# EAGLE design arm_board (EAGLE 7.4.0)

## Sheet 1 of 4: I/O
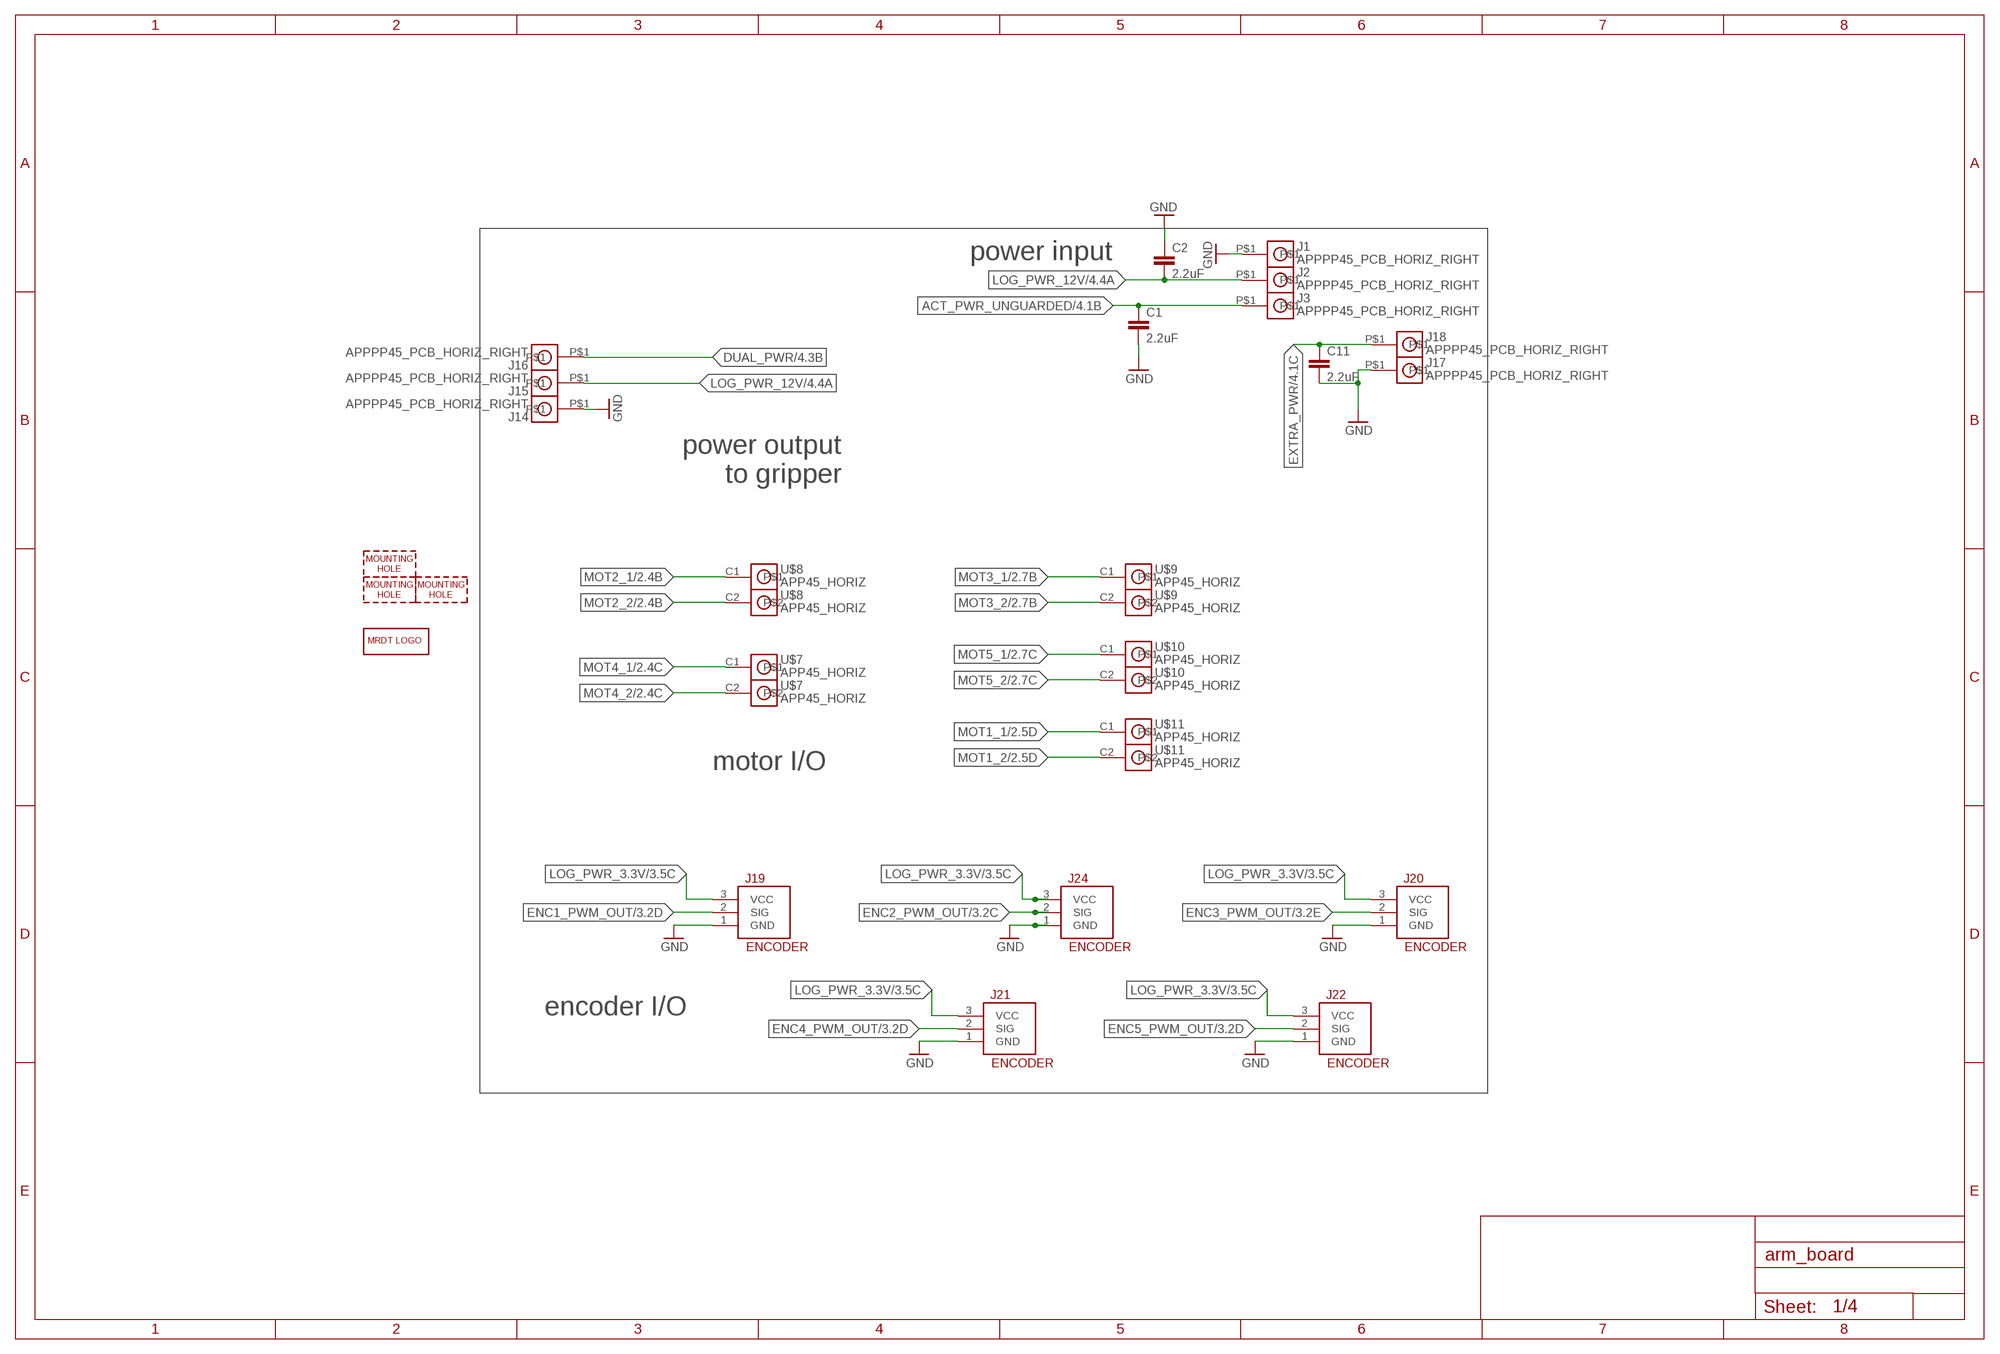
[diagram p0: schematic, sheet 1]

### Parts
C1  2.2uF  2.2UF-CERCAP-10009  [1206]
C2  2.2uF  2.2UF-CERCAP-10009  [1206]
C11  2.2uF  2.2UF-CERCAP-10009  [1206]
H1  MOUNTING_HOLE#4  [#4_SCREW]
H2  MOUNTING_HOLE#4  [#4_SCREW]
H4  MOUNTING_HOLE#4  [#4_SCREW]
J1  APPPP45_PCB_HORIZ_RIGHT  [APP45_PCB_HORIZ_RIGHT]
J2  APPPP45_PCB_HORIZ_RIGHT  [APP45_PCB_HORIZ_RIGHT]
J3  APPPP45_PCB_HORIZ_RIGHT  [APP45_PCB_HORIZ_RIGHT]
J14  APPPP45_PCB_HORIZ_RIGHT  [APP45_PCB_HORIZ_RIGHT]
J15  APPPP45_PCB_HORIZ_RIGHT  [APP45_PCB_HORIZ_RIGHT]
J16  APPPP45_PCB_HORIZ_RIGHT  [APP45_PCB_HORIZ_RIGHT]
J17  APPPP45_PCB_HORIZ_RIGHT  [APP45_PCB_HORIZ_RIGHT]
J18  APPPP45_PCB_HORIZ_RIGHT  [APP45_PCB_HORIZ_RIGHT]
J19  ENCODER  [MOLEX-70543-0002]
J20  ENCODER  [MOLEX-70543-0002]
J21  ENCODER  [MOLEX-70543-0002]
J22  ENCODER  [MOLEX-70543-0002]
J24  ENCODER  [MOLEX-70543-0002]
LOGO1  MRDT_LOGO  [MRDT_LOGO]
U$7  APP45_HORIZ  [APP45_HORIZ_CONFIG]
U$8  APP45_HORIZ  [APP45_HORIZ_CONFIG]
U$9  APP45_HORIZ  [APP45_HORIZ_CONFIG]
U$10  APP45_HORIZ  [APP45_HORIZ_CONFIG]
U$11  APP45_HORIZ  [APP45_HORIZ_CONFIG]

### Nets
ACT_PWR_UNGUARDED: C1.1 J3.P$1 ; also sheet 4
DUAL_PWR: J16.P$1 ; also sheet 4
ENC1_PWM_OUT: J19.2(SIG) ; also sheet 3
ENC2_PWM_OUT: J24.2(SIG) ; also sheet 3
ENC3_PWM_OUT: J20.2(SIG) ; also sheet 3
ENC4_PWM_OUT: J21.2(SIG) ; also sheet 3
ENC5_PWM_OUT: J22.2(SIG) ; also sheet 3
EXTRA_PWR: C11.1 J18.P$1 ; also sheet 4
GND: C1.2 C2.1 C11.2 J1.P$1 J14.P$1 J17.P$1 J19.1(GND) J20.1(GND) J21.1(GND) J22.1(GND) J24.1(GND) ; also sheet 2,3,4
LOG_PWR_3.3V: J19.3(VCC) J20.3(VCC) J21.3(VCC) J22.3(VCC) J24.3(VCC) ; also sheet 3,4
LOG_PWR_12V: C2.2 J2.P$1 J15.P$1 ; also sheet 4
MOT1_1: U$11.C1 ; also sheet 2
MOT1_2: U$11.C2 ; also sheet 2
MOT2_1: U$8.C1 ; also sheet 2
MOT2_2: U$8.C2 ; also sheet 2
MOT3_1: U$9.C1 ; also sheet 2
MOT3_2: U$9.C2 ; also sheet 2
MOT4_1: U$7.C1 ; also sheet 2
MOT4_2: U$7.C2 ; also sheet 2
MOT5_1: U$10.C1 ; also sheet 2
MOT5_2: U$10.C2 ; also sheet 2

### Notes on the sheet
- power input
- power output
  to gripper
- motor I/O
- encoder I/O

## Sheet 2 of 4: Hbridge
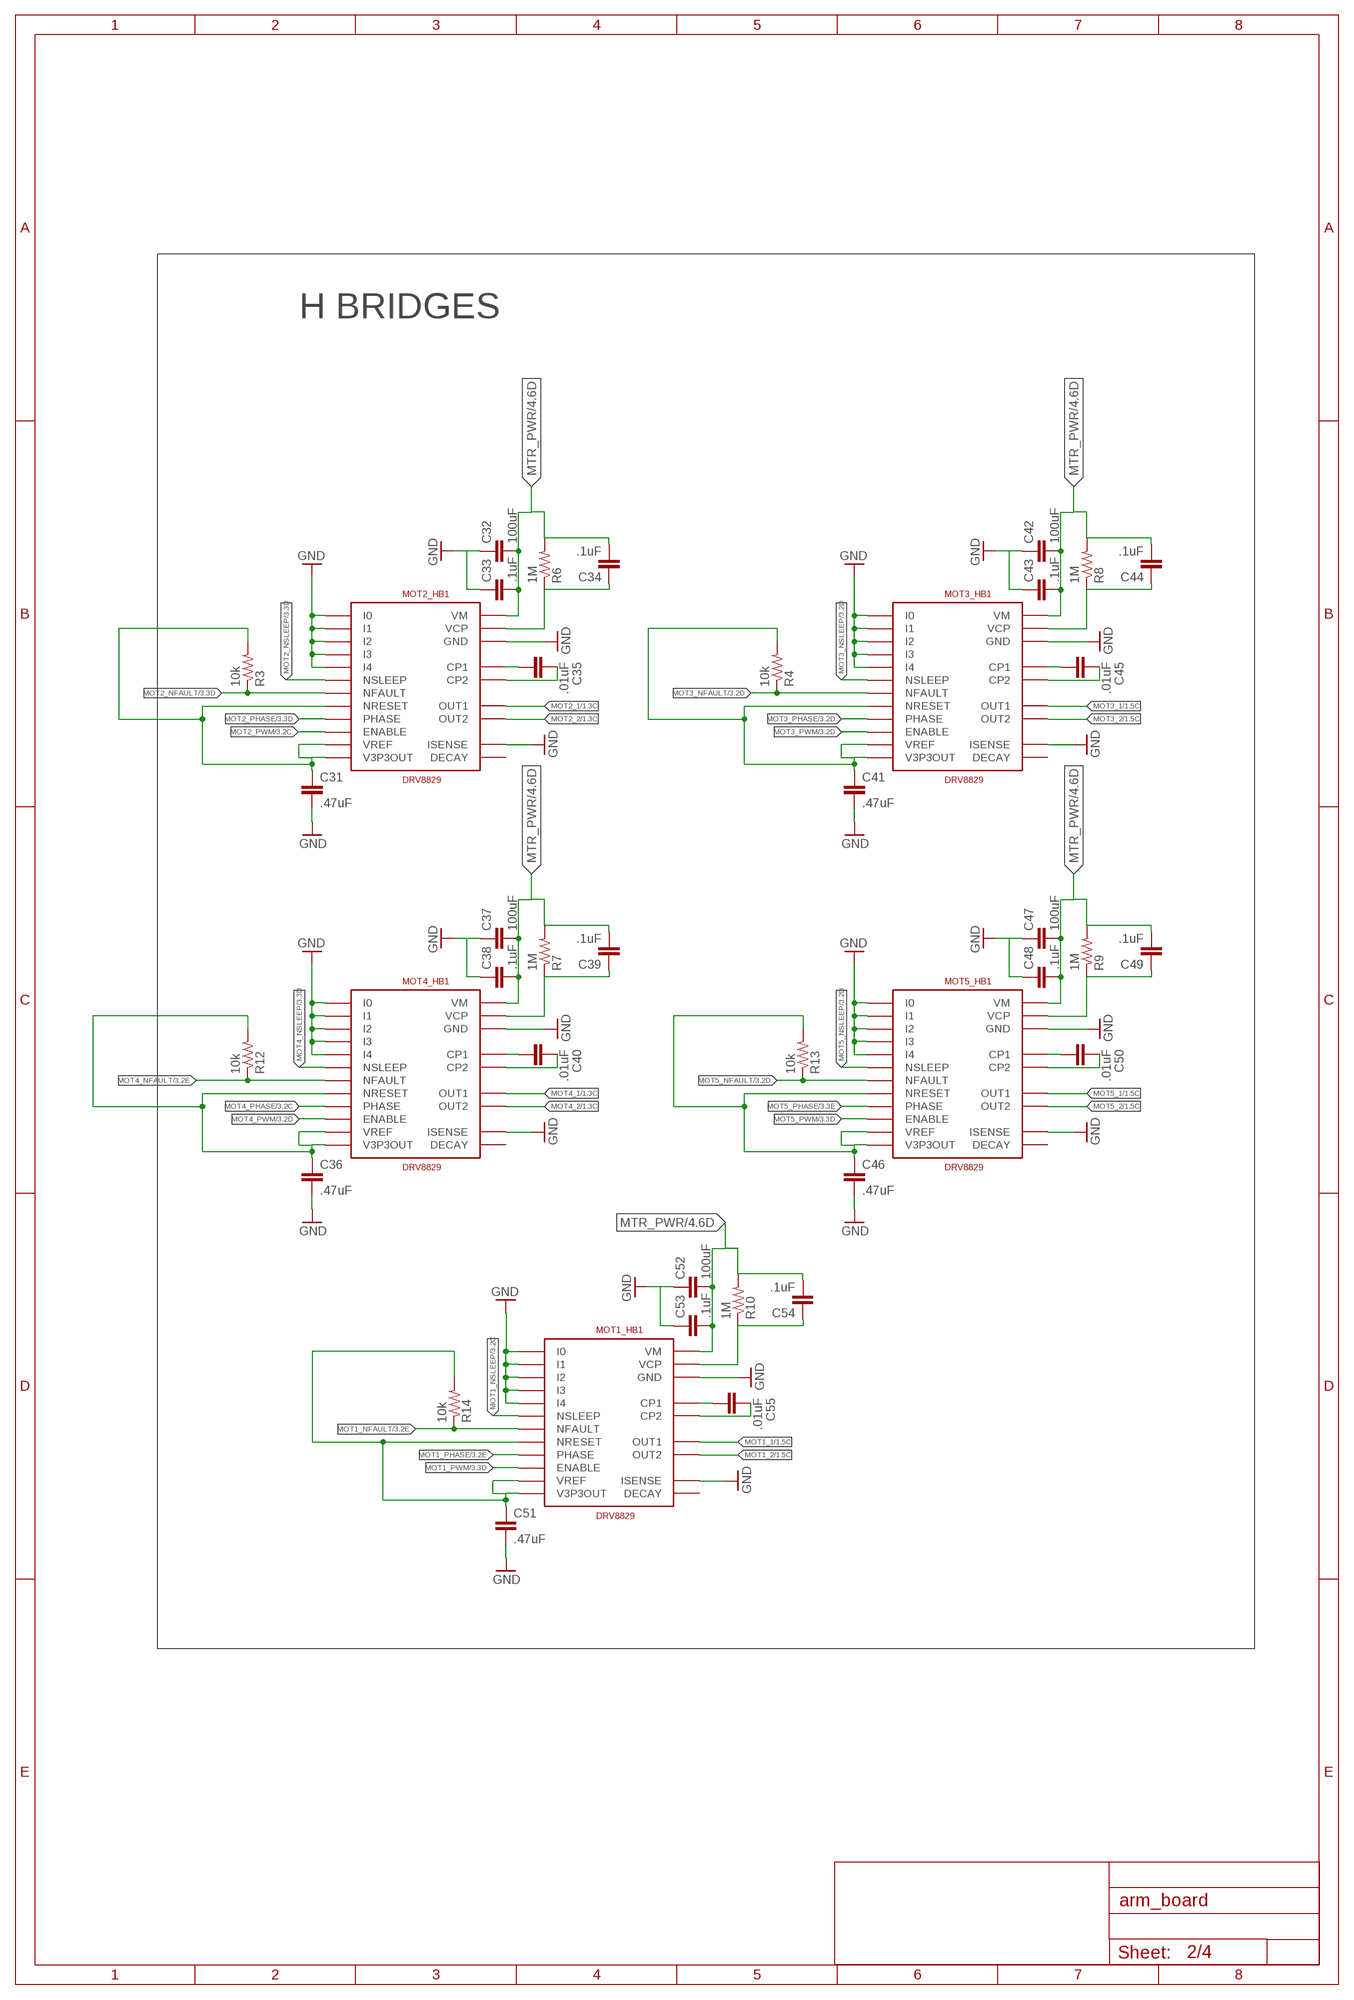
[diagram p1: schematic, sheet 2]

### Parts
C31  .47uF  0.1UF-25V(+80/-20%)(0603)  [0603-CAP]
C32  100uF  0.1UF-25V(+80/-20%)(0603)  [0603-CAP]
C33  .1uF  0.1UF-25V(+80/-20%)(0603)  [0603-CAP]
C34  .1uF  0.1UF-25V(+80/-20%)(0603)  [0603-CAP]
C35  .01uF  0.1UF-25V(+80/-20%)(0603)  [0603-CAP]
C36  .47uF  0.1UF-25V(+80/-20%)(0603)  [0603-CAP]
C37  100uF  0.1UF-25V(+80/-20%)(0603)  [0603-CAP]
C38  .1uF  0.1UF-25V(+80/-20%)(0603)  [0603-CAP]
C39  .1uF  0.1UF-25V(+80/-20%)(0603)  [0603-CAP]
C40  .01uF  0.1UF-25V(+80/-20%)(0603)  [0603-CAP]
C41  .47uF  0.1UF-25V(+80/-20%)(0603)  [0603-CAP]
C42  100uF  0.1UF-25V(+80/-20%)(0603)  [0603-CAP]
C43  .1uF  0.1UF-25V(+80/-20%)(0603)  [0603-CAP]
C44  .1uF  0.1UF-25V(+80/-20%)(0603)  [0603-CAP]
C45  .01uF  0.1UF-25V(+80/-20%)(0603)  [0603-CAP]
C46  .47uF  0.1UF-25V(+80/-20%)(0603)  [0603-CAP]
C47  100uF  0.1UF-25V(+80/-20%)(0603)  [0603-CAP]
C48  .1uF  0.1UF-25V(+80/-20%)(0603)  [0603-CAP]
C49  .1uF  0.1UF-25V(+80/-20%)(0603)  [0603-CAP]
C50  .01uF  0.1UF-25V(+80/-20%)(0603)  [0603-CAP]
C51  .47uF  0.1UF-25V(+80/-20%)(0603)  [0603-CAP]
C52  100uF  0.1UF-25V(+80/-20%)(0603)  [0603-CAP]
C53  .1uF  0.1UF-25V(+80/-20%)(0603)  [0603-CAP]
C54  .1uF  0.1UF-25V(+80/-20%)(0603)  [0603-CAP]
C55  .01uF  0.1UF-25V(+80/-20%)(0603)  [0603-CAP]
MOT1_HB1  DRV8829  [TSSOP28-GROUNDPAD]
MOT2_HB1  DRV8829  [TSSOP28-GROUNDPAD]
MOT3_HB1  DRV8829  [TSSOP28-GROUNDPAD]
MOT4_HB1  DRV8829  [TSSOP28-GROUNDPAD]
MOT5_HB1  DRV8829  [TSSOP28-GROUNDPAD]
R3  10k  RESISTOR0603-RES  [0603-RES]
R4  10k  RESISTOR0603-RES  [0603-RES]
R6  1M  RESISTOR0603-RES  [0603-RES]
R7  1M  RESISTOR0603-RES  [0603-RES]
R8  1M  RESISTOR0603-RES  [0603-RES]
R9  1M  RESISTOR0603-RES  [0603-RES]
R10  1M  RESISTOR0603-RES  [0603-RES]
R12  10k  RESISTOR0603-RES  [0603-RES]
R13  10k  RESISTOR0603-RES  [0603-RES]
R14  10k  RESISTOR0603-RES  [0603-RES]

### Nets
GND: C31.2 C32.1 C33.1 C36.2 C37.1 C38.1 C41.2 C42.1 C43.1 C46.2 C47.1 C48.1 C51.2 C52.1 C53.1 MOT1_HB1.6(ISENSE) MOT1_HB1.9(ISENSE) MOT1_HB1.14(GND) MOT1_HB1.23(I0) MOT1_HB1.24(I1) MOT1_HB1.25(I2) MOT1_HB1.26(I3) MOT1_HB1.27(I4) MOT1_HB1.28(GND) MOT1_HB1.29(GND) MOT2_HB1.6(ISENSE) MOT2_HB1.9(ISENSE) MOT2_HB1.14(GND) MOT2_HB1.23(I0) MOT2_HB1.24(I1) MOT2_HB1.25(I2) MOT2_HB1.26(I3) MOT2_HB1.27(I4) MOT2_HB1.28(GND) MOT2_HB1.29(GND) MOT3_HB1.6(ISENSE) MOT3_HB1.9(ISENSE) MOT3_HB1.14(GND) MOT3_HB1.23(I0) MOT3_HB1.24(I1) MOT3_HB1.25(I2) MOT3_HB1.26(I3) MOT3_HB1.27(I4) MOT3_HB1.28(GND) MOT3_HB1.29(GND) MOT4_HB1.6(ISENSE) MOT4_HB1.9(ISENSE) MOT4_HB1.14(GND) MOT4_HB1.23(I0) MOT4_HB1.24(I1) MOT4_HB1.25(I2) MOT4_HB1.26(I3) MOT4_HB1.27(I4) MOT4_HB1.28(GND) MOT4_HB1.29(GND) MOT5_HB1.6(ISENSE) MOT5_HB1.9(ISENSE) MOT5_HB1.14(GND) MOT5_HB1.23(I0) MOT5_HB1.24(I1) MOT5_HB1.25(I2) MOT5_HB1.26(I3) MOT5_HB1.27(I4) MOT5_HB1.28(GND) MOT5_HB1.29(GND) ; also sheet 1,3,4
HB_3.3_OUTPUT5: C31.1 MOT2_HB1.12(VREF) MOT2_HB1.13(VREF) MOT2_HB1.15(V3P3OUT) MOT2_HB1.16(NRESET) R3.2
HB_3.3_OUTPUT6: C36.1 MOT4_HB1.12(VREF) MOT4_HB1.13(VREF) MOT4_HB1.15(V3P3OUT) MOT4_HB1.16(NRESET) R12.2
HB_3.3_OUTPUT7: C41.1 MOT3_HB1.12(VREF) MOT3_HB1.13(VREF) MOT3_HB1.15(V3P3OUT) MOT3_HB1.16(NRESET) R4.2
HB_3.3_OUTPUT8: C46.1 MOT5_HB1.12(VREF) MOT5_HB1.13(VREF) MOT5_HB1.15(V3P3OUT) MOT5_HB1.16(NRESET) R13.2
HB_3.3_OUTPUT9: C51.1 MOT1_HB1.12(VREF) MOT1_HB1.13(VREF) MOT1_HB1.15(V3P3OUT) MOT1_HB1.16(NRESET) R14.2
MOT1_1: MOT1_HB1.5(OUT1) MOT1_HB1.10(OUT1) ; also sheet 1
MOT1_2: MOT1_HB1.7(OUT2) MOT1_HB1.8(OUT2) ; also sheet 1
MOT1_NFAULT: MOT1_HB1.18(NFAULT) R14.1 ; also sheet 3
MOT1_NSLEEP: MOT1_HB1.17(NSLEEP) ; also sheet 3
MOT1_PHASE: MOT1_HB1.20(PHASE) ; also sheet 3
MOT1_PWM: MOT1_HB1.21(ENABLE) ; also sheet 3
MOT2_1: MOT2_HB1.5(OUT1) MOT2_HB1.10(OUT1) ; also sheet 1
MOT2_2: MOT2_HB1.7(OUT2) MOT2_HB1.8(OUT2) ; also sheet 1
MOT2_NFAULT: MOT2_HB1.18(NFAULT) R3.1 ; also sheet 3
MOT2_NSLEEP: MOT2_HB1.17(NSLEEP) ; also sheet 3
MOT2_PHASE: MOT2_HB1.20(PHASE) ; also sheet 3
MOT2_PWM: MOT2_HB1.21(ENABLE) ; also sheet 3
MOT3_1: MOT3_HB1.5(OUT1) MOT3_HB1.10(OUT1) ; also sheet 1
MOT3_2: MOT3_HB1.7(OUT2) MOT3_HB1.8(OUT2) ; also sheet 1
MOT3_NFAULT: MOT3_HB1.18(NFAULT) R4.1 ; also sheet 3
MOT3_NSLEEP: MOT3_HB1.17(NSLEEP) ; also sheet 3
MOT3_PHASE: MOT3_HB1.20(PHASE) ; also sheet 3
MOT3_PWM: MOT3_HB1.21(ENABLE) ; also sheet 3
MOT4_1: MOT4_HB1.5(OUT1) MOT4_HB1.10(OUT1) ; also sheet 1
MOT4_2: MOT4_HB1.7(OUT2) MOT4_HB1.8(OUT2) ; also sheet 1
MOT4_NFAULT: MOT4_HB1.18(NFAULT) R12.1 ; also sheet 3
MOT4_NSLEEP: MOT4_HB1.17(NSLEEP) ; also sheet 3
MOT4_PHASE: MOT4_HB1.20(PHASE) ; also sheet 3
MOT4_PWM: MOT4_HB1.21(ENABLE) ; also sheet 3
MOT5_1: MOT5_HB1.5(OUT1) MOT5_HB1.10(OUT1) ; also sheet 1
MOT5_2: MOT5_HB1.7(OUT2) MOT5_HB1.8(OUT2) ; also sheet 1
MOT5_NFAULT: MOT5_HB1.18(NFAULT) R13.1 ; also sheet 3
MOT5_NSLEEP: MOT5_HB1.17(NSLEEP) ; also sheet 3
MOT5_PHASE: MOT5_HB1.20(PHASE) ; also sheet 3
MOT5_PWM: MOT5_HB1.21(ENABLE) ; also sheet 3
MTR_PWR: C32.2 C33.2 C34.2 C37.2 C38.2 C39.2 C42.2 C43.2 C44.2 C47.2 C48.2 C49.2 C52.2 C53.2 C54.2 MOT1_HB1.4(VM) MOT1_HB1.11(VM) MOT2_HB1.4(VM) MOT2_HB1.11(VM) MOT3_HB1.4(VM) MOT3_HB1.11(VM) MOT4_HB1.4(VM) MOT4_HB1.11(VM) MOT5_HB1.4(VM) MOT5_HB1.11(VM) R6.2 R7.2 R8.2 R9.2 R10.2 ; also sheet 4
N$17: C34.1 MOT2_HB1.3(VCP) R6.1
N$18: C35.2 MOT2_HB1.1(CP1)
N$19: C35.1 MOT2_HB1.2(CP2)
N$20: C39.1 MOT4_HB1.3(VCP) R7.1
N$21: C40.2 MOT4_HB1.1(CP1)
N$22: C40.1 MOT4_HB1.2(CP2)
N$23: C44.1 MOT3_HB1.3(VCP) R8.1
N$24: C45.2 MOT3_HB1.1(CP1)
N$25: C45.1 MOT3_HB1.2(CP2)
N$26: C49.1 MOT5_HB1.3(VCP) R9.1
N$27: C50.2 MOT5_HB1.1(CP1)
N$28: C50.1 MOT5_HB1.2(CP2)
N$29: C54.1 MOT1_HB1.3(VCP) R10.1
N$30: C55.2 MOT1_HB1.1(CP1)
N$31: C55.1 MOT1_HB1.2(CP2)
Unconnected: MOT1_HB1.19(DECAY) MOT2_HB1.19(DECAY) MOT3_HB1.19(DECAY) MOT4_HB1.19(DECAY) MOT5_HB1.19(DECAY)

### Notes on the sheet
- H BRIDGES

## Sheet 3 of 4: Computers
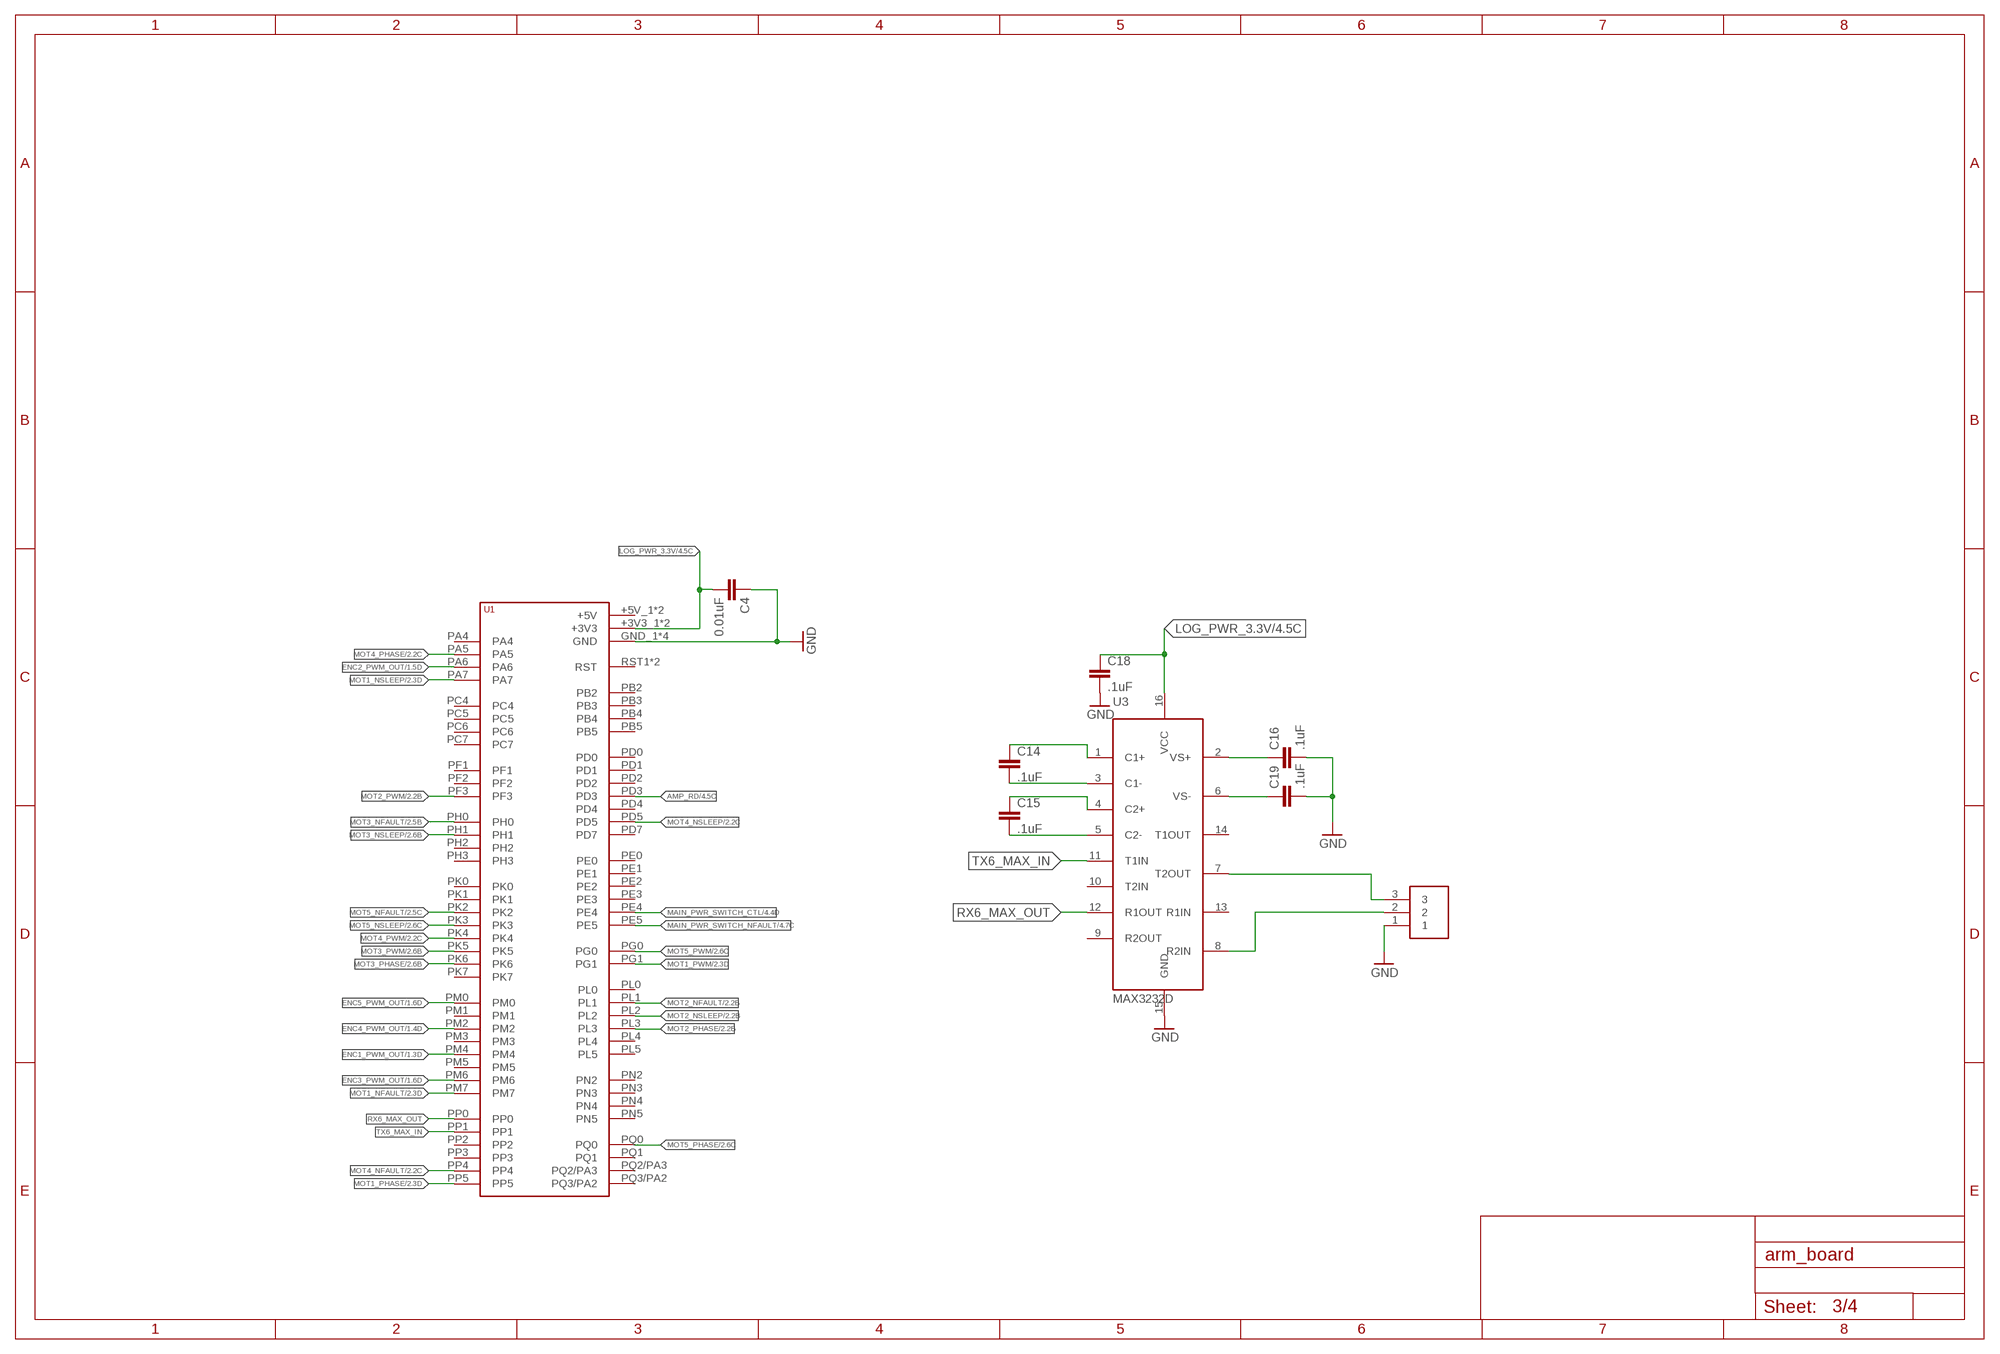
[diagram p2: schematic, sheet 3]

### Parts
C4  0.01uF  0.1UF-25V-5%(0603)  [0603-CAP]
C14  .1uF  2.2UF-25V-+80/-20(0805)  [0805]
C15  .1uF  2.2UF-25V-+80/-20(0805)  [0805]
C16  .1uF  2.2UF-25V-+80/-20(0805)  [0805]
C18  .1uF  2.2UF-25V-+80/-20(0805)  [0805]
C19  .1uF  2.2UF-25V-+80/-20(0805)  [0805]
RS232_IO  SL03  [MOLEX-70543-0002]
U1  TIVA-1294  [TIVA-C-CONNECTED]
U3  MAX3232D  [SOIC16]

### Nets
AMP_RD: U1.PD3 ; also sheet 4
ENC1_PWM_OUT: U1.PM4 ; also sheet 1
ENC2_PWM_OUT: U1.PA6 ; also sheet 1
ENC3_PWM_OUT: U1.PM6 ; also sheet 1
ENC4_PWM_OUT: U1.PM2 ; also sheet 1
ENC5_PWM_OUT: U1.PM0 ; also sheet 1
GND: C4.1 C16.2 C18.2 C19.2 RS232_IO.1 U1.GND_1(GND) U1.GND_2(GND) U1.GND_3(GND) U1.GND_4(GND) U3.15(GND) ; also sheet 1,2,4
LOG_PWR_3.3V: C4.2 C18.1 U1.+3V3_1(+3V3) U1.+3V3_2(+3V3) U3.16(VCC) ; also sheet 1,4
MAIN_PWR_SWITCH_CTL: U1.PE4 ; also sheet 4
MAIN_PWR_SWITCH_NFAULT: U1.PE5 ; also sheet 4
MOT1_NFAULT: U1.PM7 ; also sheet 2
MOT1_NSLEEP: U1.PA7 ; also sheet 2
MOT1_PHASE: U1.PP5 ; also sheet 2
MOT1_PWM: U1.PG1 ; also sheet 2
MOT2_NFAULT: U1.PL1 ; also sheet 2
MOT2_NSLEEP: U1.PL2 ; also sheet 2
MOT2_PHASE: U1.PL3 ; also sheet 2
MOT2_PWM: U1.PF3 ; also sheet 2
MOT3_NFAULT: U1.PH0 ; also sheet 2
MOT3_NSLEEP: U1.PH1 ; also sheet 2
MOT3_PHASE: U1.PK6 ; also sheet 2
MOT3_PWM: U1.PK5 ; also sheet 2
MOT4_NFAULT: U1.PP4 ; also sheet 2
MOT4_NSLEEP: U1.PD5 ; also sheet 2
MOT4_PHASE: U1.PA5 ; also sheet 2
MOT4_PWM: U1.PK4 ; also sheet 2
MOT5_NFAULT: U1.PK2 ; also sheet 2
MOT5_NSLEEP: U1.PK3 ; also sheet 2
MOT5_PHASE: U1.PQ0 ; also sheet 2
MOT5_PWM: U1.PG0 ; also sheet 2
N$5: C14.1 U3.1(C1+)
N$6: C14.2 U3.3(C1-)
N$9: C15.1 U3.4(C2+)
N$10: C15.2 U3.5(C2-)
N$12: C16.1 U3.2(VS+)
N$13: C19.1 U3.6(VS-)
N$14: RS232_IO.3 U3.7(T2OUT)
N$15: RS232_IO.2 U3.8(R2IN)
RX6_MAX_OUT: U1.PP0 U3.12(R1OUT)
TX6_MAX_IN: U1.PP1 U3.11(T1IN)
Unconnected: U1.+5V_1(+5V) U1.+5V_2(+5V) U1.PA4 U1.PB2 U1.PB3 U1.PB4 U1.PB5 U1.PC4 U1.PC5 U1.PC6 U1.PC7 U1.PD0 U1.PD1 U1.PD2 U1.PD4 U1.PD7 U1.PE0 U1.PE1 U1.PE2 U1.PE3 U1.PF1 U1.PF2 U1.PH2 U1.PH3 U1.PK0 U1.PK1 U1.PK7 U1.PL0 U1.PL4 U1.PL5 U1.PM1 U1.PM3 U1.PM5 U1.PN2 U1.PN3 U1.PN4 U1.PN5 U1.PP2 U1.PP3 U1.PQ1 U1.PQ2/PA3 U1.PQ3/PA2 U1.RST1(RST) U1.RST_2(RST) U3.9(R2OUT) U3.10(T2IN) U3.13(R1IN) U3.14(T1OUT)

## Sheet 4 of 4: Power
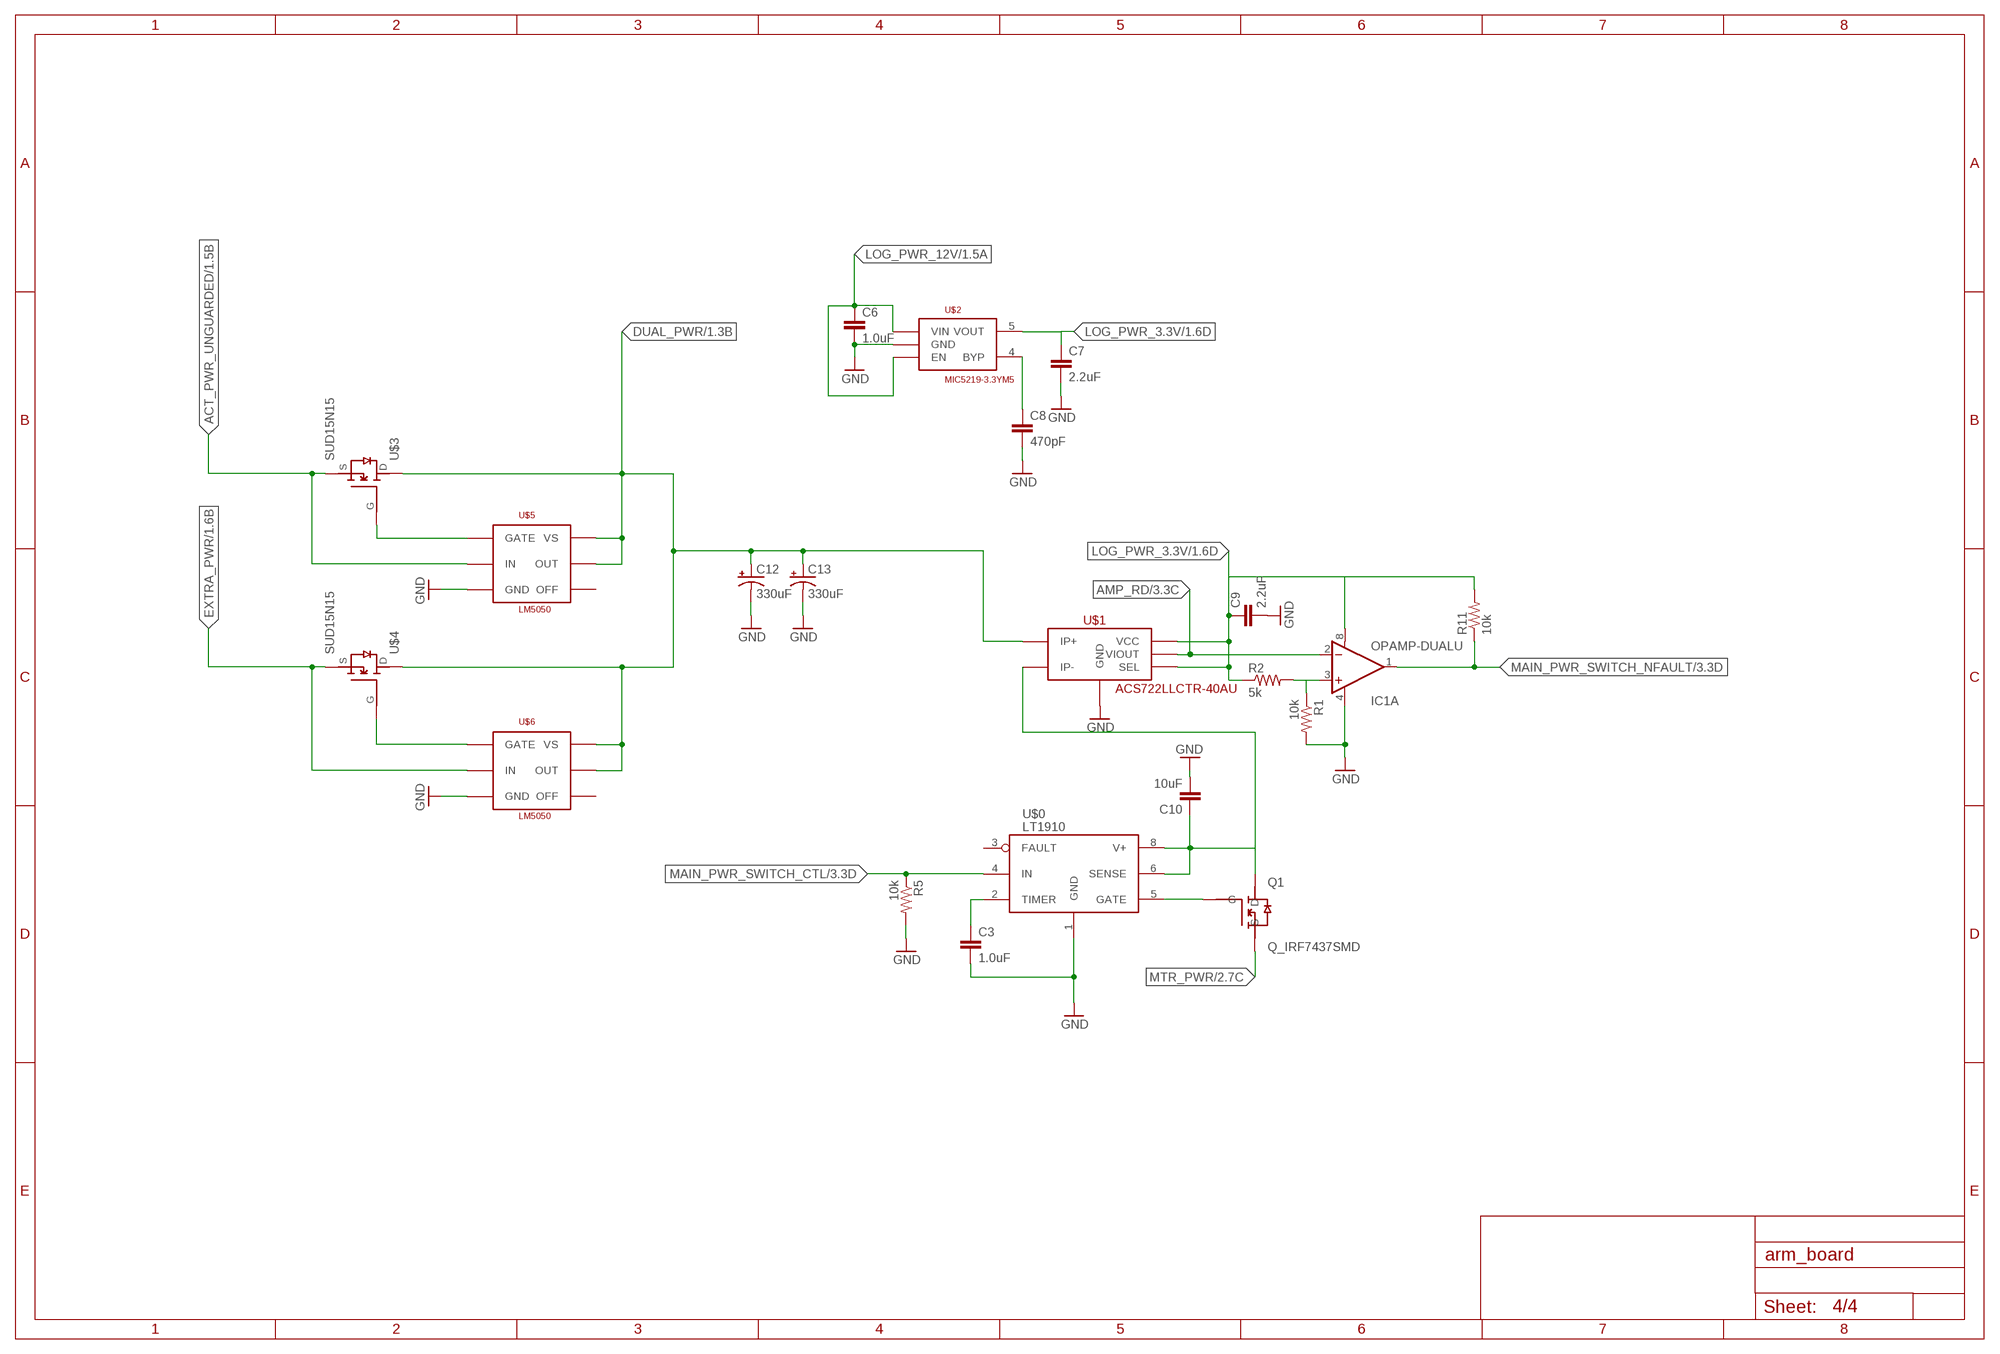
[diagram p3: schematic, sheet 4]

### Parts
C3  1.0uF  1.0UF-16V-10%(0603)  [0603-CAP]
C6  1.0uF  1.0UF-16V-10%(0603)  [0603-CAP]
C7  2.2uF  0.1UF-25V(+80/-20%)(0603)  [0603-CAP]
C8  470pF  0.1UF-25V(+80/-20%)(0603)  [0603-CAP]
C9  2.2uF  0.1UF-25V(+80/-20%)(0603)  [0603-CAP]
C10  10uF  1UF-25V-10%(0805)  [0805]
C12  330uF  CAP_POLC  [PANASONIC_C]
C13  330uF  CAP_POLC  [PANASONIC_C]
IC1  OPAMP-DUALU  [SO08]
Q1  Q_IRF7437SMD  [D2PACK]
R1  10k  RESISTOR0603-RES  [0603-RES]
R2  5k  RESISTOR0603-RES  [0603-RES]
R5  10k  RESISTOR0603-RES  [0603-RES]
R11  10k  RESISTOR0603-RES  [0603-RES]
U$0  LT1910  [SO8]
U$1  ACS722LLCTR-40AU  ACS722LL  [SOIC8]
U$2  MIC5219-3.3YM5  [SOT-23-5]
U$3  SUD15N15  [TO252]
U$4  SUD15N15  [TO252]
U$5  LM5050  [TSOT23-6]
U$6  LM5050  [TSOT23-6]

### Nets
$N3: C10.1 Q1.TAB(D) U$0.6(SENSE) U$0.8(V+) U$1.3(IP-) U$1.4(IP-)
ACT_PWR_UNGUARDED: U$3.2(S) U$5.4(IN) ; also sheet 1
AMP_RD: IC1.2(A:-IN) U$1.7(VIOUT) ; also sheet 3
DUAL_PWR: C12.+ C13.+ U$1.1(IP+) U$1.2(IP+) U$3.3(D) U$4.3(D) U$5.1(VS) U$5.6(OUT) U$6.1(VS) U$6.6(OUT) ; also sheet 1
EXTRA_PWR: U$4.2(S) U$6.4(IN) ; also sheet 1
GND: C3.2 C6.2 C7.2 C8.2 C9.2 C10.2 C12.- C13.- IC1.4(A:V-) R1.2 R5.2 U$0.1(GND) U$1.5(GND) U$2.2(GND) U$5.2(GND) U$6.2(GND) ; also sheet 1,2,3
LOG_PWR_3.3V: C7.1 C9.1 IC1.8(A:V+) R2.1 R11.2 U$1.6(SEL) U$1.8(VCC) U$2.5(VOUT) ; also sheet 1,3
LOG_PWR_12V: C6.1 U$2.1(VIN) U$2.3(EN) ; also sheet 1
MAIN_PWR_SWITCH_CTL: R5.1 U$0.4(IN) ; also sheet 3
MAIN_PWR_SWITCH_NFAULT: IC1.1(A:OUT) R11.1 ; also sheet 3
MTR_PWR: Q1.2(S) ; also sheet 2
N$1: C3.1 U$0.2(TIMER)
N$2: C8.1 U$2.4(BYP)
N$3: Q1.1(G) U$0.5(GATE)
N$7: IC1.3(A:+IN) R1.1 R2.2
N$8: U$3.1(G) U$5.5(GATE)
N$11: U$4.1(G) U$6.5(GATE)
Unconnected: IC1.5(B:+IN) IC1.6(B:-IN) IC1.7(B:OUT) U$0.3(FAULT) U$5.3(OFF) U$6.3(OFF)

## Library data of the parts
C1 C2 C11 = SparkFun-Capacitors:2.2UF-CER: 2.2uF Ceramic SMT CAP-07888- 10V, 20% (0603) CAP-10009- 50V, 10% (1206); PROD_ID: CAP-10009
C3 C6 = SparkFun-Capacitors:1.0UF-16V-10%(0603): CAP-00868; PROD_ID: CAP-00868
C4 = SparkFun-Capacitors:0.1UF-25V-5%(0603): CAP-08604; PROD_ID: CAP-08604; VALUE: 0.1uF
C7-C9 C31-C55 = SparkFun-Capacitors:0.1UF-25V(+80/-20%)(0603): Ceramic Standard decoupling cap CAP-00810; PROD_ID: CAP-00810; VALUE: 0.1uF
C10 = SparkFun-Capacitors:1UF-25V-10%(0805): CAP-08064; PROD_ID: CAP-08064; VALUE: 1uF
C12 C13 = SparkFun-Capacitors:CAP_POL: Capacitor Polarized These are standard SMD and PTH capacitors. Normally 10uF, 47uF, and 100uF in electrolytic and tantalum varieties. Always verify the external diameter of the through hole cap, it varies with capacity, voltage, and manufacturer. The EIA devices should be standard.
C14-C16 C18 C19 = SparkFun-Capacitors:2.2UF-25V-+80/-20(0805); PROD_ID: CAP-11624; VALUE: 2.2uF
H1 H2 H4 = MRDT-Hardware:MOUNTING_HOLE: Mounting hole for M6 bolt. Standard use mounting hole for: Tiva C Connected - M6 Anderson Powerpole Mounting Wing - M8 Most frame-mounted PCB's - M8
IC1 = SparkFun-AnalogIC:OPAMP-DUAL: Generic op-amp footprint
J1-J3 J14-J18 = MRDT-Connectors:APP: http://www.powerwerx.com/anderson-powerpoles/
J19-J22 J24 = mine:ENCODER
LOGO1 = MRDT-Hardware:MRDT_LOGO
MOT1_HB1 MOT2_HB1 MOT3_HB1 MOT4_HB1 MOT5_HB1 = lin reg:DRV8829: 5A 45V H bridge, OC protection
Q1 = MRDT-2015-PowerBoard:Q_IRF*7437: 40V 195A N-CH MOSFET switch with heatsink
R1-R14 = SparkFun-Passives:RESISTOR: Resistor Basic schematic elements and footprints for 0603, 1206, and PTH resistors.
RS232_IO = MRDT-Connectors:SL03: Molex 3-pin SL connector Locking 3 pin connector with standard header spacing. Backward compatible with standard RC servo connectors.
U1 = MRDT-Microcontrollers:TIVA-1294: TIVA C CONNECTED LAUNCHPAD
U3 = MRDT-ICs:MAX*232; OPERATING_VOLTAGE: 3V3
U$0 = MRDT-2015-PowerBoard:LT1910
U$1 = lin reg:ACS722LL: Current sensor, outputs analog voltage
U$2 = lin reg:MIC5219-3.3YM5: 12v to 3.3v LDO, 500mA peak
U$3 U$4 = mine:SUD15N15: NMOS 150V 15A
U$5 U$6 = mine:LM5050: High-Side OR-ing FET Controller
U$7-U$11 = mine:APP45_HORIZ: Two stacked andersons, laying down horizontally

## Board
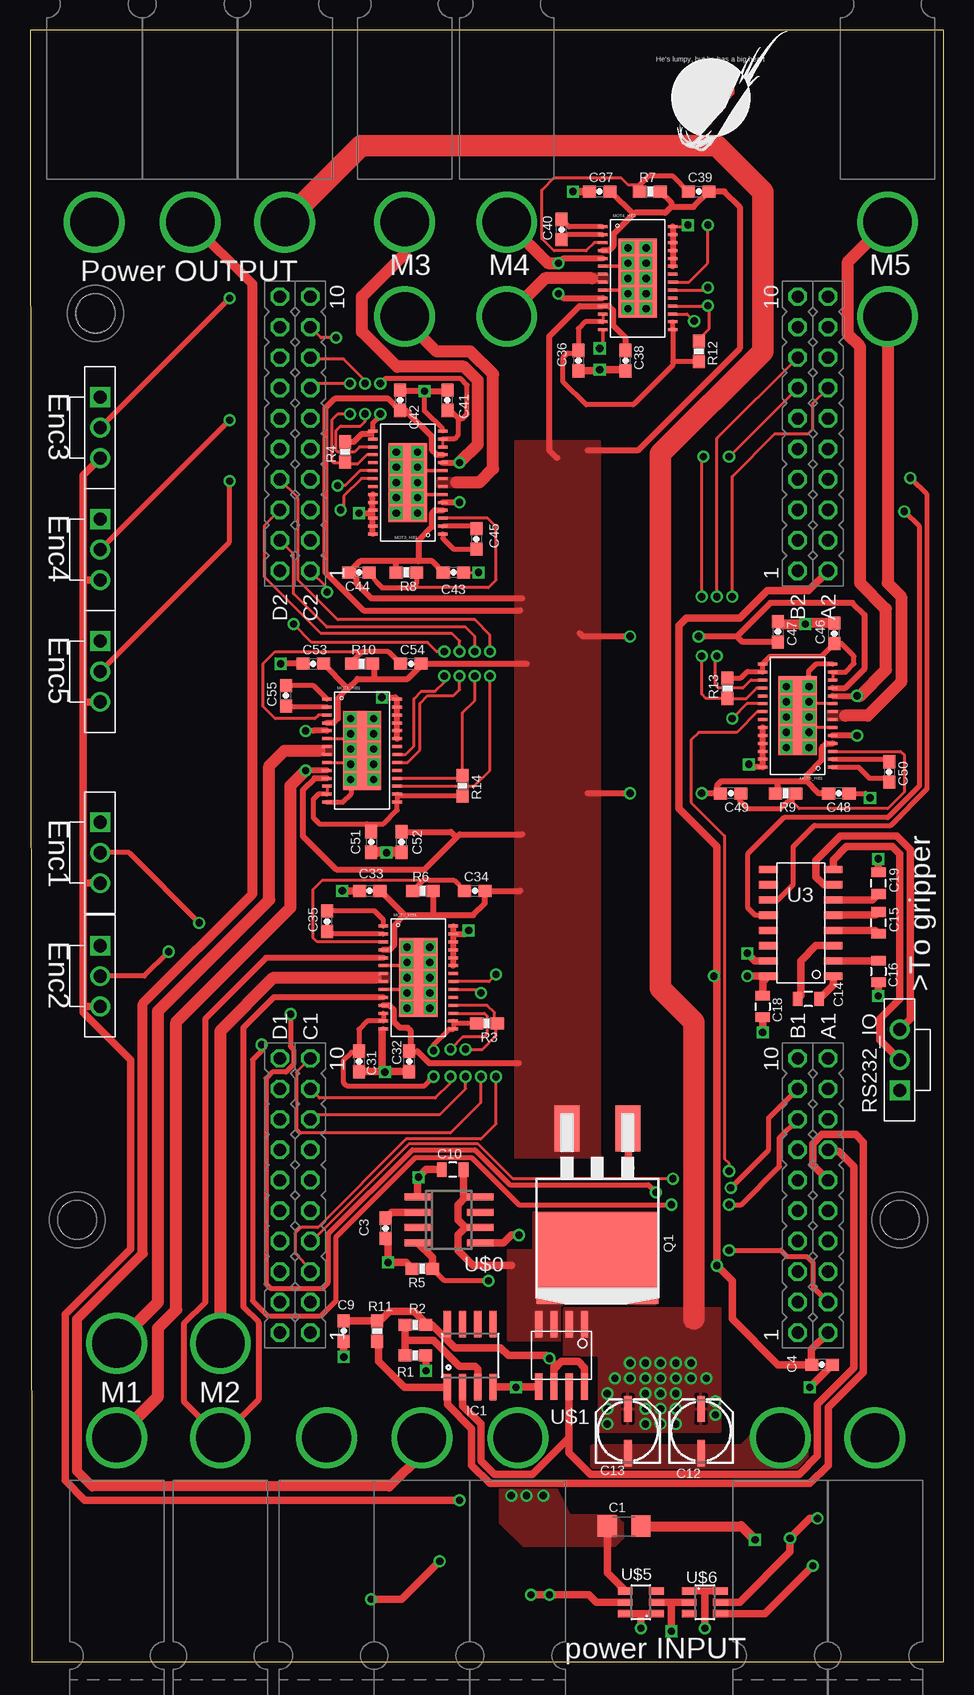
[diagram p4: board, top side]
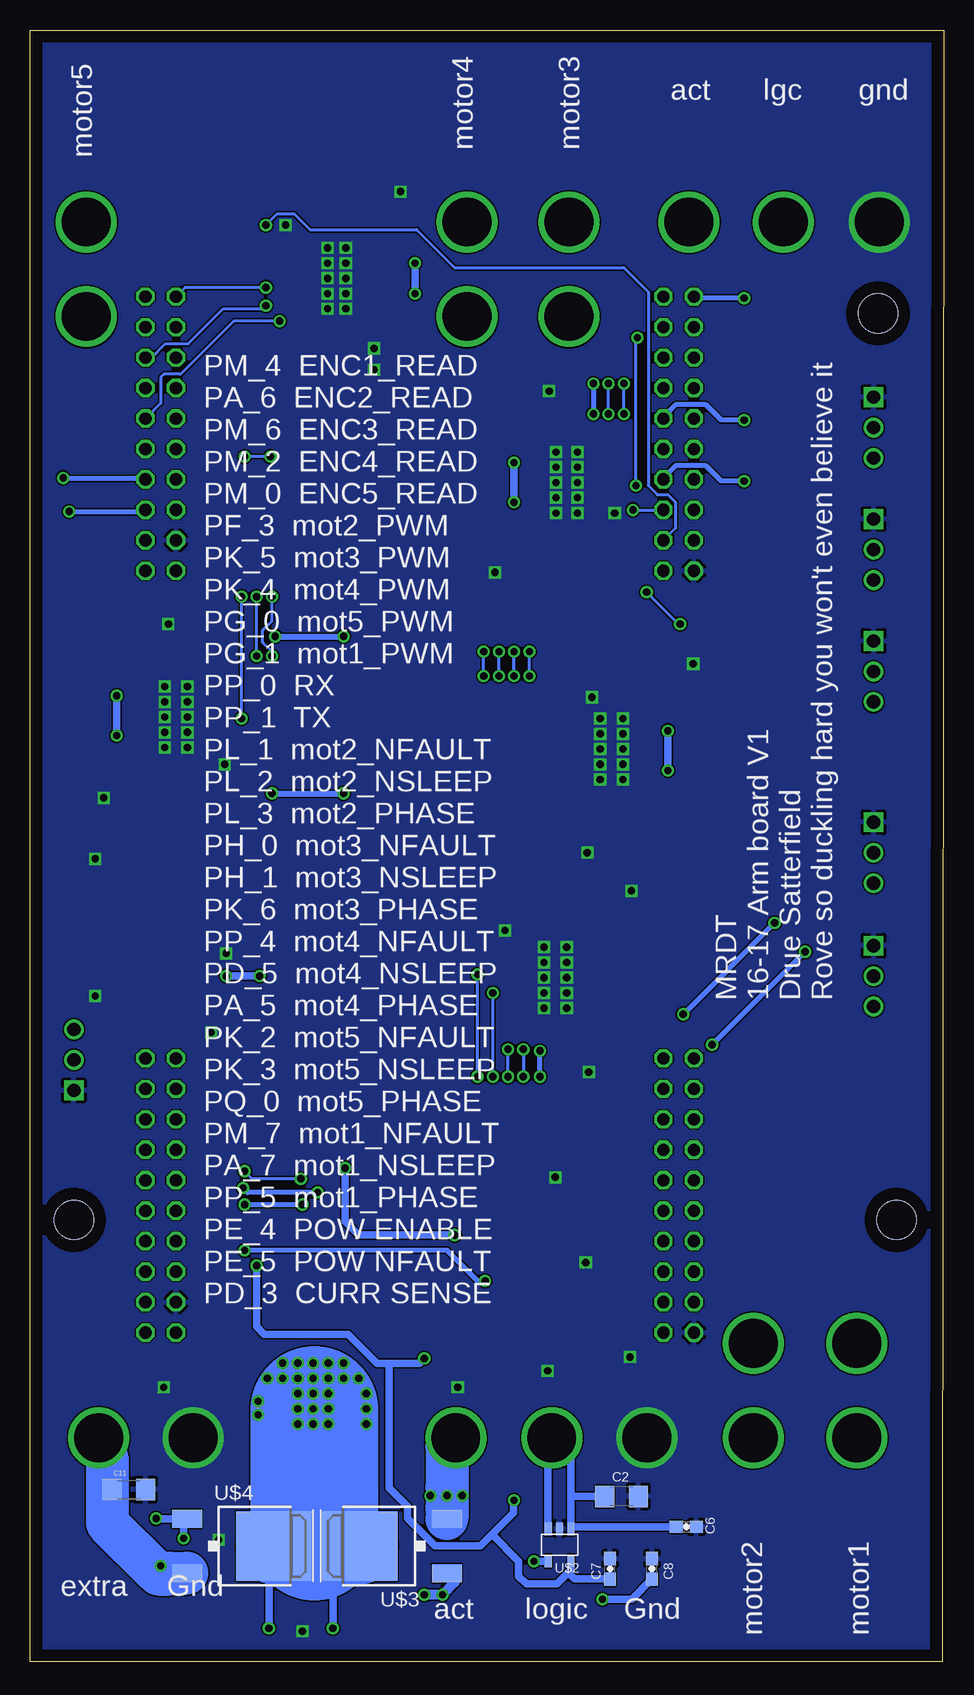
[diagram p5: board, bottom side, seen from below]

Size 76.18 x 136.02 mm. Coordinates in mm from the lower left corner, seen from the top.
Outline: 0.13,0 76.18,0 76.18,136.02 0,136.02 0,135.56 0.13,0
Copper layers (1*16): Top 0.035mm / dielectric 1.5mm / Bottom 0.035mm
Design rules "advanced_circuits_standard *": minimum track width 5mil, minimum drill 10mil, track to track 5mil, track to pad 5mil, pad to pad 5mil, via to via 5mil, smd to smd 5mil, copper to edge 40mil, drill to drill 5mil, minimum pad ring 10mil, minimum via ring 8mil, stop-mask expansion 4mil, vias tented up to drill 0mil, thermal gap 10mil

### Footprints (pad centres in the part's own frame; a part is rotated, then mirrored left to right if it is on the bottom)
1206 = smd 1.6 x 1.8: 1 -1.4,0; 2 1.4,0
0603-CAP = smd 1.1 x 1: 1 -0.85,0; 2 0.85,0
0805 = smd 0.8 x 1.2: 1 -0.9,0; 2 0.9,0
PANASONIC_C = smd 2.2 x 0.65: + 1.9,-0.2; - -1.8,-0.2
#4_SCREW = hole 3.264: 0,0
SO08 = smd 0.61 x 2.21: 1 -1.905,-2.616; 2 -0.635,-2.616; 3 0.635,-2.616; 4 1.905,-2.616; 5 1.905,2.616; 6 0.635,2.616; 7 -0.635,2.616; 8 -1.905,2.616
APP45_PCB_HORIZ_RIGHT = drill 4.064: P$1 28.194,3.969
MOLEX-70543-0002 = drill 1.1 square: 1 2.54,0 | drill 1.1: 2 0,0; 3 -2.54,0
TSSOP28-GROUNDPAD = smd 0.8 x 0.25: 1 -2.921,4.298; 2 -2.921,3.637; 3 -2.921,2.977; 4 -2.921,2.317; 5 -2.921,1.656; 6 -2.921,0.996; 7 -2.921,0.335; 8 -2.927,-0.325; 9 -2.921,-0.985; 10 -2.921,-1.646; 11 -2.921,-2.306; 12 -2.921,-2.967; 13 -2.921,-3.627; 14 -2.921,-4.287; 15 2.921,-4.287; 16 2.921,-3.627; 17 2.921,-2.967; 18 2.921,-2.306; 19 2.921,-1.646; 20 2.921,-0.985; 21 2.927,-0.325; 22 2.921,0.335; 23 2.921,0.996; 24 2.921,1.656; 25 2.921,2.317; 26 2.921,2.977; 27 2.921,3.637; 28 2.921,4.298 | smd 3.2 x 6.6: 29 0,0.005
D2PACK = smd 2.083 x 3.81: 1 2.54,-4.191; 2 7.62,-4.191 | smd 10.16 x 7.62: TAB 5.08,6.604
0603-RES = smd 1.1 x 1: 1 -0.85,0; 2 0.85,0
TIVA-C-CONNECTED = drill 1.016 octagon: +3V3_1 59.69,54.61; +3V3_2 123.19,54.61; +5V_1 59.69,52.07; +5V_2 123.19,52.07; GND_1 57.15,52.07; GND_2 59.69,8.89; GND_3 120.65,52.07; GND_4 123.19,8.89; PA4 39.37,52.07; PA5 36.83,52.07; PA6 105.41,52.07; PA7 52.07,8.89; PB2 102.87,54.61; PB3 100.33,54.61; PB4 54.61,52.07; PB5 52.07,52.07; PC4 118.11,54.61; PC5 115.57,54.61; PC6 113.03,54.61; PC7 105.41,54.61; PD0 107.95,8.89; PD1 110.49,8.89; PD2 57.15,54.61; PD3 107.95,54.61; PD4 49.53,54.61; PD5 46.99,54.61; PD7 107.95,52.07; PE0 118.11,52.07; PE1 115.57,52.07; PE2 113.03,52.07; PE3 110.49,52.07; PE4 120.65,54.61; PE5 110.49,54.61; PF1 123.19,11.43; PF2 120.65,11.43; PF3 118.11,11.43; PG0 115.57,11.43; PG1 59.69,11.43; PH0 44.45,11.43; PH1 41.91,11.43; PH2 118.11,8.89; PH3 115.57,8.89; PK0 49.53,52.07; PK1 46.99,52.07; PK2 44.45,52.07; PK3 41.91,52.07; PK4 57.15,11.43; PK5 54.61,11.43; PK6 39.37,11.43; PK7 36.83,11.43; PL0 107.95,11.43; PL1 105.41,11.43; PL2 102.87,11.43; PL3 100.33,11.43; PL4 113.03,11.43; PL5 110.49,11.43; PM0 52.07,11.43; PM1 49.53,11.43; PM2 46.99,11.43; PM3 120.65,8.89; PM4 102.87,52.07; PM5 100.33,52.07; PM6 36.83,8.89; PM7 57.15,8.89; PN2 105.41,8.89; PN3 102.87,8.89; PN4 36.83,54.61; PN5 39.37,54.61; PP0 54.61,54.61; PP1 52.07,54.61; PP2 100.33,8.89; PP3 41.91,8.89; PP4 41.91,54.61; PP5 54.61,8.89; PQ0 44.45,54.61; PQ1 39.37,8.89; PQ2/PA3 46.99,8.89; PQ3/PA2 44.45,8.89; RST1 49.53,8.89; RST_2 113.03,8.89
SOIC16 = smd 0.6 x 1.55: 1 -4.445,-2.7; 2 -3.175,-2.7; 3 -1.905,-2.7; 4 -0.635,-2.7; 5 0.635,-2.7; 6 1.905,-2.7; 7 3.175,-2.7; 8 4.445,-2.7; 9 4.445,2.7; 10 3.175,2.7; 11 1.905,2.7; 12 0.635,2.7; 13 -0.635,2.7; 14 -1.905,2.7; 15 -3.175,2.7; 16 -4.445,2.7
SO8 = smd 0.6 x 2.2: 1 -1.905,-2.6; 2 -0.635,-2.6; 3 0.635,-2.6; 4 1.905,-2.6; 5 1.905,2.6; 6 0.635,2.6; 7 -0.635,2.6; 8 -1.905,2.6
SOIC8 = smd 2.2 x 0.6: 1 -2.6,1.905; 2 -2.6,0.635; 3 -2.6,-0.635; 4 -2.6,-1.905; 5 2.6,-1.905; 6 2.6,-0.635; 7 2.6,0.635; 8 2.6,1.905
SOT-23-5 = smd 0.6 x 1.05: 1 -2.45,-0.475; 2 -1.5,-0.475; 3 -0.55,-0.475; 4 -0.55,2.225; 5 -2.45,2.225
TO252 = smd 1.5 x 2.5: 1 -2.28,-4.8; 2 2.28,-4.8 | smd 5.8 x 6.4: 3 0,2.5
TSOT23-6 = smd 0.62 x 1.22: 1 -0.95,-1.3; 2 0,-1.3; 3 0.95,-1.3; 4 0.95,1.3; 5 0,1.3; 6 -0.95,1.3
APP45_HORIZ_CONFIG = drill 4.064: C1 28.194,3.937; C2 36.068,3.937

### Placement (x,y rotation side)
C1  49.53,11.3 0 top
C2  26.86,13.78 180 bottom
C3  29.65,36.13 270 top
C4  66.04,24.77 180 top
C6  21.46,11.24 0 bottom
C7  27.81,7.75 90 bottom
C8  24.32,7.75 90 bottom
C9  26.16,27.56 270 top
C10  35.24,41.02 180 top
C11  67.94,14.35 0 bottom
C12  55.75,19.18 90 top
C13  49.66,19.18 90 top
C14  64.9,55.24 180 top
C15  70.74,61.59 90 top
C16  70.74,57.53 270 top
C18  61.09,54.61 270 top
C19  70.74,64.9 90 top
C31  27.43,50.04 270 top
C32  31.62,50.04 90 top
C33  28.32,64.26 0 top
C34  37.08,64.26 0 top
C35  24.77,61.72 90 top
C36  45.72,108.46 270 top
C37  47.5,122.56 0 top
C38  49.66,108.46 90 top
C39  55.75,122.56 0 top
C40  44.32,119.38 90 top
C41  34.8,105.16 90 top
C42  30.86,105.16 270 top
C43  35.31,90.81 180 top
C44  27.43,90.81 180 top
C45  37.21,93.6 270 top
C46  67.06,85.72 90 top
C47  62.36,85.85 270 top
C48  67.44,72.39 180 top
C49  58.42,72.39 180 top
C50  71.63,74.17 270 top
C51  28.45,68.33 270 top
C52  30.99,68.33 90 top
C53  23.62,83.19 0 top
C54  31.75,83.19 0 top
C55  21.34,80.52 90 top
H1  5.46,112.39 0 top
H2  3.94,36.83 0 top
H4  72.52,36.83 0 top
IC1  36.7,25.53 0 top
J1  28.7,-9.53 90 top
J2  36.64,-9.53 90 top
J3  44.64,-9.53 90 top
J14  1.4,148.21 270 top
J15  9.4,148.21 270 top
J16  17.27,148.21 270 top
J17  66.55,-9.53 90 top
J18  74.42,-9.53 90 top
J19  5.84,67.44 90 top
J20  5.84,102.87 90 top
J21  5.84,92.71 90 top
J22  5.84,82.55 90 top
J24  5.84,57.15 90 top
LOGO1  53.47,125.09 0 top
MOT1_HB1  27.69,75.95 0 top
MOT2_HB1  32.39,57.02 0 top
MOT3_HB1  31.5,98.3 180 top
MOT4_HB1  50.67,115.32 0 top
MOT5_HB1  64.01,78.87 180 top
Q1  52.39,40.26 180 top
R1  32.13,25.53 0 top
R2  32.13,28.07 180 top
R3  38.1,53.21 180 top
R4  26.29,100.84 90 top
R5  32.7,32.77 180 top
R6  32.77,64.26 0 top
R7  51.69,122.56 0 top
R8  31.37,90.81 180 top
R9  62.99,72.39 180 top
R10  27.69,83.19 0 top
R11  28.96,27.56 90 top
R12  55.75,109.22 270 top
R13  58.17,81.15 90 top
R14  36.07,73.03 270 top
RS232_IO  72.52,50.16 270 top
U1  11.94,150.62 270 top
U3  64.26,61.59 90 top
U$0  34.93,36.83 270 top
U$1  44.32,25.53 270 top
U$2  33.53,10.6 180 bottom
U$3  46.23,9.65 90 bottom
U$4  58.29,9.65 270 bottom
U$5  50.93,4.95 90 top
U$6  56.26,4.95 270 top
U$7  35.81,148.21 270 top
U$8  19.81,-9.53 90 top
U$9  27.3,148.21 270 top
U$10  67.56,148.21 270 top
U$11  11.18,-9.53 90 top

### Tracks (layer width: path | path; a pad name or v marks a point on that pad's centre or on a via)
$N3
  Top 0.61: U$0.8 36.32,38.73 | 36.32,38.73 35.69,38.1 35.69,36.83 36.32,36.2 | 36.32,36.2 U$0.6 | C10.1 36.14,38.91 36.32,38.73 | 36.32,36.2 35.69,35.56 35.69,34.29 36.96,33.02 40.13,33.02
  pour Top (rank 2, no thermals): 44.32,26.8 39.88,26.8 39.88,34.29 42.04,34.29 42.04,37.47 52.2,37.47 52.2,29.84 44.32,29.84
ACT_PWR_UNGUARDED  (via drill 0.6)
  Top 0.305: 41.43,13.97 41.4,13.94 v41.4,13.84
  Top 0.61: U$5.4 48.13,7.4 C1.1
  Bottom 0.254: 41.43,12.85 41.4,13.46
  Bottom 0.305: 41.4,13.46 v41.4,13.84 41.4,14.58 41.43,14.61
  Bottom 0.61: U$3.2 41.43,11.33 41.4,11.3
  Bottom 3.6: U$3.2 41.43,12.85 41.43,14.61 41.43,17.91 J3.P$1
  other vias: 42.8,13.84 40.13,13.84
  pour Top (no thermals): 39.24,14.73 43.69,14.73 44.96,12.19 48.77,12.19 49.4,11.56 49.4,10.29 48.77,9.65 41.15,9.65 39.24,11.56
AMP_RD
  Top 0.61: U$1.7 44.96,18.67 | 44.96,18.67 44.96,17.4 46.74,15.62 64.13,15.62 65.66,17.14 65.66,21.46 68.71,24.51 68.71,41.27 67.44,42.55 66.67,42.55 U1.PD3 | 44.96,18.67 41.91,15.62 38.73,15.62 37.59,16.76 37.59,19.81 36.07,21.34 IC1.2
DUAL_PWR  (via drill 0.6)
  Top 0.61: 56.26,5.9 U$6.6 | U$5.6 50.93,4 | U$5.1 50.93,4 | 54.92,28.13 55.37,28.57 | 50.93,4 v50.93,2.79 | U$6.1 56.26,5.9 | 56.26,5.9 v56.26,2.79
  Top 1.778: 55.37,28.57 55.37,53.34 52.58,56.13 52.58,100.71 61.09,109.22 61.09,122.56 57.28,126.36 27.59,126.36 J16.P$1
  Bottom 0.61: 53.85,9.14 54.48,10.29 U$4.3 55.79,7.37 56.26,7.37 v56.26,2.79 | 51.31,9.14 51.31,9.65 | 52.45,10.41 52.07,10.41 51.31,9.14 | v50.93,2.79 50.93,6.6 51.31,6.6 51.31,9.14
  Bottom 10: 52.45,20.95 v52.58,21.08
  Bottom 10.668: 52.45,10.41 52.45,20.95
  Bottom 6.452: U$3.3 51.31,9.65 U$4.3
  other vias: 52.58,22.35 52.58,23.62 52.58,24.89 51.31,24.89 50.04,24.89 53.85,24.89 55.12,24.89 55.12,23.62 53.85,23.62 51.31,23.62 50.04,23.62 53.85,22.35 57.15,20.57 56.39,23.62 48.77,23.62 51.31,21.08 51.31,19.81 48.13,19.81 48.13,21.08 51.31,22.35 53.85,21.08 48.13,22.35 52.58,19.81 53.85,19.81 57.15,21.72
  pour Top: 57.53,19.18 47.5,19.18 47.5,26.16 57.53,26.16
  pour Top (no thermals): 47.5,25.27 47.5,25.53 44.58,25.53 44.58,29.46 57.53,29.46 57.53,25.27
ENC1_PWM_OUT  (via drill 0.6)
  Top 0.406: v14.1,61.59 8.26,67.44 J19.2 | v21.72,53.98 21.72,51.31 21.97,51.05 21.97,49.78 21.34,49.15 20.19,49.15 19.68,48.64 19.68,31.5 20.07,31.11 24.38,31.11 24.89,31.62 24.89,35.69 31.88,42.67 37.08,42.67 40.01,39.75 51.56,39.75 v52.2,39.12 | v58.42,39.5 61.6,42.67 61.6,45.34 U1.PM4
  Bottom 0.406: v14.1,61.59 v21.72,53.98 | v52.2,39.12 58.04,39.12 v58.42,39.5
ENC2_PWM_OUT  (via drill 0.6)
  Top 0.406: v19.3,51.44 19.3,50.93 18.54,50.16 18.54,30.1 19.81,28.83 24.26,28.83 25.53,30.1 25.53,35.43 32.13,42.04 36.83,42.04 40.77,38.1 v53.47,38.1 | v58.29,38.1 59.31,38.1 62.48,41.27 62.48,43.69 U1.PA6 | v11.56,59.18 9.53,57.15 J24.2
  Bottom 0.406: v11.56,59.18 v19.3,51.44 | v53.47,38.1 v58.29,38.1
ENC3_PWM_OUT  (via drill 0.6)
  Top 0.406: J20.2 v16.64,113.67
  Bottom 0.406: v16.64,113.67 20.7,113.67 U1.PM6
ENC4_PWM_OUT  (via drill 0.6)
  Top 0.406: J21.2 v16.64,103.5
  Bottom 0.406: v16.64,103.5 18.54,103.5 19.81,104.78 22.35,104.78 23.37,103.76 U1.PM2
ENC5_PWM_OUT  (via drill 0.6)
  Top 0.406: J22.2 16.64,93.34 v16.64,98.42
  Bottom 0.406: v16.64,98.42 18.54,98.42 19.81,99.69 22.35,99.69 23.37,98.68 U1.PM0
EXTRA_PWR  (via drill 0.6)
  Top 0.254: v65.28,8.01 v65.28,8
  Top 0.61: U$6.4 61.27,4 v65.28,8.01
  Bottom 0.61: v65.28,8 65.91,8 65.91,8.01
  Bottom 0.813: v65.28,8 65.66,7.62 65.66,7.49
  Bottom 1.778: C11.1 70.36,18.76 J18.P$1
  Bottom 3.6: J18.P$1 69.72,16.86 69.72,11.56 65.66,7.49 65.47,7.31 64.58,7.31 64.51,7.37 U$4.2
GND  (via drill 0.6)
  Top 0.254: MOT5_HB1.6 65.36,77.87 v64.96,77.47 | MOT5_HB1.9 65.12,79.85 v64.96,80.01 | MOT1_HB1.6 26.33,76.94 v26.73,77.34 | MOT1_HB1.9 26.58,74.96 v26.73,74.8 | C43.1 v37.4,90.81 | 53.59,119.63 54.74,119.63 v54.86,119.76
  Top 0.305: MOT2_HB1.6 31.16,58.02 v31.43,58.29 | MOT2_HB1.9 31.15,56.04 v31.43,55.75 | v31.43,57.02 MOT2_HB1.29 | MOT3_HB1.9 32.61,99.28 v32.32,99.57 | MOT3_HB1.6 32.6,97.3 v32.32,97.03 | v32.32,98.3 MOT3_HB1.29 | MOT4_HB1.6 49.57,116.31 v49.85,116.59 | MOT4_HB1.9 49.56,114.33 v49.85,114.05 | 33.56,59.34 v33.34,59.56 | 30.32,95.98 v30.54,95.76 | 51.65,116.31 v51.37,116.59 51.75,116.2 | 62.75,75.89 v63.05,76.2 | 28.95,78.92 v28.64,78.61 | MOT4_HB1.14 47.75,109.73 v47.5,109.47
  Top 0.406: MOT3_HB1.14 34.42,102.74 32.89,104.27 v32.89,105.92 | C48.1 69.66,72.39 v70.04,72.01 | MOT5_HB1.14 65.5,83.15 64.9,82.55 64.9,81.34 v64.96,81.28 | MOT1_HB1.14 26.07,71.66 26.8,72.39 26.8,73.47 v26.73,73.53
  Top 0.508: MOT2_HB1.14 29.34,52.61 | C53.1 v20.89,83.19 | C41.2 34.71,105.92 v32.89,105.92 30.95,105.92 C42.1 | MOT3_HB1.28 MOT3_HB1.27 MOT3_HB1.26 MOT3_HB1.25 | MOT3_HB1.25 MOT3_HB1.24 MOT3_HB1.23 | v27.43,95.76 28.35,95.76 MOT3_HB1.25 | MOT1_HB1.23 MOT1_HB1.24 MOT1_HB1.25 MOT1_HB1.26 MOT1_HB1.27 MOT1_HB1.28 30.46,80.39 v29.34,80.39 | 53.59,119.63 MOT4_HB1.28 MOT4_HB1.27 MOT4_HB1.26 MOT4_HB1.25 MOT4_HB1.24 MOT4_HB1.23 | MOT2_HB1.23 MOT2_HB1.24 MOT2_HB1.25 MOT2_HB1.26 MOT2_HB1.27 | MOT2_HB1.27 MOT2_HB1.28 | MOT2_HB1.27 36.28,60.66 v36.58,60.96 | MOT5_HB1.23 MOT5_HB1.24 MOT5_HB1.25 MOT5_HB1.26 MOT5_HB1.27 MOT5_HB1.28 60.18,74.57 v59.94,74.8
  Top 0.61: C31.2 29.55,49.19 v29.59,49.15 | C32.1 29.63,49.19 v29.59,49.15 | v26.73,76.07 27.56,76.07 MOT1_HB1.29 | U$5.2 53.47,4.95 | 53.47,4.95 U$6.2 | IC1.4 40.51,22.91 | 40.51,22.91 42.4,22.91 U$1.5 | v40.51,22.86 40.51,22.91 | 29.34,52.61 29.34,49.4 v29.59,49.15 | v29.72,67.44 29.68,67.44 arc-45 29.59,67.48 | C37.1 v45.28,122.56 | C36.2 47.41,107.61 v47.5,107.7 49.57,107.7 C38.1 | MOT5_HB1.29 63.18,78.86 v63.05,78.74 | MOT4_HB1.29 v51.37,115.32 | v26.04,64.26 C33.1 | 53.47,4.95 v53.47,2.54 | C16.2 v70.74,55.5 | U3.15 60.45,58.42 v59.82,59.05 | C18.2 v61.09,52.45 | C4.1 66.89,24.73 v65.02,22.86 | U$0.1 32.33,40.33 v32.39,40.39 33.02,41.02 C10.2 | C3.2 29.65,34.96 29.84,34.77 v29.84,33.27 31.34,33.27 R5.2 | R1.2 33.02,25.53 v33.02,24.26 | C9.2 v26.16,25.4 | C19.2 v70.74,66.93
  Top 0.813: C46.2 64.73,86.58 v64.64,86.49 62.57,86.49 C47.1 | C52.1 29.59,67.48 C51.2 | C1.2 59.31,11.3 v60.45,10.16
  other vias: 33.34,57.02 33.34,55.75 33.34,54.48 31.43,54.48 30.54,98.3 30.54,99.57 30.54,100.84 32.32,100.84 32.32,95.76 49.85,117.86 49.85,115.32 49.85,112.78 51.37,114.05 51.37,112.78 63.06,80.01 63.06,81.28 64.96,76.2 64.96,78.74 28.64,76.07 28.64,74.8 28.64,73.53 63.06,77.47 33.34,58.29 30.54,97.03 51.37,117.86 28.64,77.34 31.43,59.56 26.73,78.61
  pour Bottom: -11.56,150.62 48.39,150.62 48.39,135.89 66.8,135.89 66.8,151.13 78.87,151.13 78.87,-3.81 -12.19,-3.81
  pour Top (no thermals): 46.86,12.95 46.86,18.03 59.31,18.03 61.21,19.94 64.39,19.94 64.77,19.56 64.77,12.95
HB_3.3_OUTPUT5  (via drill 0.6)
  Top 0.254: 34.87,53.4 MOT2_HB1.16
  Top 0.406: MOT2_HB1.12 MOT2_HB1.13 28.12,53.4 27.43,52.7 C31.1 27.34,50.8 26.8,50.8 26.16,50.16 26.16,48.26 26.42,48.01 32.89,48.01 v33.66,48.77 | v33.66,50.93 33.66,51.44 34.93,52.7 35.31,52.7 MOT2_HB1.15 MOT2_HB1.16 35.49,53.21 R3.2
  Bottom 0.406: v33.66,48.77 v33.66,50.93
HB_3.3_OUTPUT6
  Top 0.254: MOT4_HB1.12 MOT4_HB1.13
  Top 0.406: MOT4_HB1.13 46.28,111.69 45.72,111.12 C36.1 45.51,109.09 44.83,109.09 44.45,108.71 44.45,106.68 46.36,104.78 50.29,104.78 53.59,108.08 53.59,108.37 | MOT4_HB1.16 MOT4_HB1.15 53.59,108.37 | R12.2 53.59,108.37
HB_3.3_OUTPUT7  (via drill 0.6)
  Top 0.254: MOT3_HB1.15 MOT3_HB1.16 | MOT3_HB1.12 MOT3_HB1.13
  Top 0.406: 35.69,103.63 35.69,103.67 35.05,104.31 C41.1 | 35.69,103.63 35.69,102.23 35.38,101.92 MOT3_HB1.13 | 35.69,103.63 36.07,103.63 36.45,104.01 36.45,106.43 35.94,106.93 29.59,106.93 v29.21,106.55 | MOT3_HB1.15 28.57,103.25 29.21,103.89 v29.21,104.01
  Top 0.508: R4.2 27.01,101.69 27.69,102.36 28.35,102.36 MOT3_HB1.15
  Bottom 0.406: v29.21,106.55 v29.21,104.01
HB_3.3_OUTPUT8
  Top 0.254: MOT5_HB1.13 MOT5_HB1.12
  Top 0.406: MOT5_HB1.13 68.02,82.49 68.71,83.19 68.71,83.82 67.65,84.88 C46.1 | 67.06,84.84 C46.1 | R13.2 59.27,82 59.82,82.55 61.03,82.55 MOT5_HB1.16 MOT5_HB1.15 61.09,83.19 61.72,83.82 66,83.82 C46.1
HB_3.3_OUTPUT9
  Top 0.254: MOT1_HB1.12 MOT1_HB1.13
  Top 0.406: R14.2 30.75,72.17 MOT1_HB1.16 MOT1_HB1.15 30.61,70.99 29.46,69.85 28.07,69.85 | MOT1_HB1.13 24.06,72.32 23.62,71.88 23.62,70.36 24.13,69.85 28.07,69.85 | C51.1 28.45,69.47 28.07,69.85
LOG_PWR_3.3V  (via drill 0.6)
  Top 0.61: 43.69,24.38 44.32,25.02 45.72,25.02 46.23,24.51 U$1.8 | 43.69,24.38 43.69,24.89 v43.31,25.27 43.05,25.53 39.88,25.53 39.24,26.16 35.43,26.16 34.8,26.8 | 34.8,26.8 IC1.8 | 65.19,26.07 U1.+3V3_2 | 57.28,57.4 57.28,67.94 54.1,71.12 54.1,86.36 54.74,87 59.18,87 61.47,89.28 64.9,89.28 U1.+3V3_1 | 57.28,57.4 v57.28,33.02 58.55,31.75 58.55,28.57 62.36,24.77 65.15,24.77 | v35.81,13.46 4.57,13.46 2.92,15.11 2.92,28.96 8.38,34.42 8.38,50.16 4.44,54.1 4.44,54.61 | 4.44,54.61 4.44,64.9 | 4.44,64.9 4.44,80.01 | 4.44,80.01 4.44,90.17 | 4.44,90.17 4.44,98.93 J20.3 | C18.1 61.09,56.67 U3.16 v59.82,57.15 | v57.02,57.15 57.28,57.4 | 43.69,24.38 U$1.6 | C4.2 65.15,24.77 | 65.15,26.04 65.15,24.77 | 34.8,26.8 33.53,28.07 R2.1 32.98,28.23 32,29.21 29.97,29.21 29.17,28.41 R11.2 C9.1 | J22.3 4.44,80.01 | J21.3 4.44,90.17 | J24.3 4.44,54.61 | J19.3 4.44,64.9
  Bottom 0.61: 37.66,10.6 35.85,12.41 35.85,13.46 v35.81,13.46 | 37.66,10.6 38.61,9.65 42.42,9.65 44.7,11.94 44.7,12.95 46.23,14.48 46.23,24.64 46.48,24.89 | U$2.5 31.08,7.66 31.3,7.43 | 37.66,10.6 35.43,8.38 35.43,7.11 34.8,6.48 32.26,6.48 31.3,7.43 | C7.1 30.77,6.9 31.3,7.43 | v57.28,33.02 57.28,27.94 56.64,27.3 49.66,27.3 47.24,24.89 46.48,24.89 | v59.82,57.15 v57.02,57.15 | 46.48,24.89 43.69,24.89 v43.31,25.27 43.24,25.34
LOG_PWR_12V
  Top 0.813: J2.P$1 32.67,17.3 29.97,14.61 5.21,14.61 3.94,15.88 3.94,28.57 9.4,34.04 9.4,54.86 18.54,64.01 18.54,114.84 J15.P$1
  Bottom 0.61: U$2.3 32.98,18.36 J2.P$1 31.08,17.08 31.08,13.97 | 31.08,13.97 U$2.1 30.92,11.24 C6.1 | C2.2 30.89,13.78 31.08,13.97
MAIN_PWR_SWITCH_CTL  (via drill 0.6)
  Top 0.406: U1.PE4 65.28,31.24 65.28,33.27 64.77,33.78 63.12,33.78 62.61,34.29 v58.29,34.29 | v38.23,31.75 34.57,31.75 R5.1
  Top 0.61: U$0.4 33.55,33.7 R5.1
  Bottom 0.406: v58.29,34.29 41.4,34.29 38.86,31.75 v38.23,31.75
MAIN_PWR_SWITCH_NFAULT
  Top 0.61: U1.PE5 65.28,41.4 65.28,43.18 66.04,43.94 68.83,43.94 69.47,43.31 69.47,24.13 66.55,21.21 66.55,16.38 65.02,14.86 38.35,14.86 36.83,16.38 36.83,19.43 34.8,21.46 IC1.1 34.75,22.86 31.24,22.86 29.08,25.02 29.08,26.58 R11.1
MOT1_1  (via drill 0.6)
  Top 0.508: MOT1_HB1.5 23.63,77.6 v22.99,77.6 | MOT1_HB1.10 23.63,74.3 v22.99,74.3
  Top 1.016: U$11.C1 10.67,22.1 10.67,27.81 12.19,29.34 12.19,53.34 21.72,62.87 21.72,73.03 v22.99,74.3
  Bottom 0.61: v22.99,77.6 v22.99,74.3
MOT1_2
  Top 0.254: MOT1_HB1.7
  Top 1.016: 24.13,75.95 21.21,75.95 19.94,74.68 19.94,63.5 10.67,54.23 10.67,29.97 U$11.C2
  pour Top (no thermals): 25.15,75.56 23.24,75.56 23.24,76.33 25.15,76.33
MOT1_NFAULT  (via drill 0.6)
  Top 0.254: MOT1_HB1.18 35.83,73.64 R14.1 36.07,79.12 37.08,80.14 v37.08,82.17 | U1.PM7 21.97,92.33 21.97,89.03 24.77,86.23 36.32,86.23 37.08,85.47 v37.08,84.2
  Bottom 0.254: v37.08,82.17 v37.08,84.2
MOT1_NSLEEP  (via drill 0.6)
  Top 0.254: U1.PA7 22.35,97.03 22.35,90.17 25.65,86.87 37.08,86.87 38.35,85.6 v38.35,84.2 | MOT1_HB1.17 37.04,72.98 38.35,74.3 v38.35,82.17
  Bottom 0.254: v38.35,82.17 v38.35,84.2
MOT1_PHASE  (via drill 0.6)
  Top 0.254: MOT1_HB1.20 31.46,74.96 32.51,76.01 32.51,79.88 33.15,80.52 35.31,80.52 35.81,81.03 v35.81,82.17 | U1.PP5 19.56,94.74 19.56,90.42 24.26,85.72 35.18,85.72 35.81,85.09 v35.81,84.2
  Bottom 0.254: v35.81,82.17 v35.81,84.2
MOT1_PWM  (via drill 0.6)
  Top 0.254: MOT1_HB1.21 31.3,75.62 32,76.33 32,80.26 32.64,80.9 33.78,80.9 34.54,81.66 v34.54,82.17 | v34.54,84.2 33.91,84.2 33.15,84.96 23.49,84.96 v21.97,86.49 | v24.77,89.15 24.77,89.53 U1.PG1
  Bottom 0.254: v34.54,82.17 v34.54,84.2 | v21.97,86.49 22.1,86.49 v24.77,89.15
MOT2_1
  Top 0.508: MOT2_HB1.5 27.3,58.68 27.3,58.67 19.68,58.67 14.61,53.59 14.61,29.97 12.83,28.19 12.83,21.72 U$8.C1 19.05,21.84 19.05,28.32 17.78,29.59 17.78,52.83 20.32,55.38 MOT2_HB1.10 27.3,55.38
MOT2_2
  Top 1.016: 28.83,57.02 20.32,57.02 15.88,52.58 U$8.C2
  pour Top (no thermals): 29.84,56.64 28.19,56.64 28.19,57.4 29.84,57.4
MOT2_NFAULT  (via drill 0.6)
  Top 0.254: U1.PL1 23.75,45.59 34.16,45.59 36.32,47.75 v36.32,48.77 | MOT2_HB1.18 38.12,54.72 38.73,54.1 38.73,53.43 R3.1 38.86,53.12 38.86,52.2 37.72,51.05 v36.32,51.05
  Bottom 0.254: v36.32,48.77 v36.32,51.05
MOT2_NSLEEP  (via drill 0.6)
  Top 0.254: U1.PL2 24.13,46.99 33.78,46.99 35.05,48.26 v35.05,48.77 | MOT2_HB1.17 37.89,54.06 38.1,53.85 38.1,52.32 37.85,52.07 36.07,52.07 v35.05,51.05
  Bottom 0.254: v35.05,51.05 v35.05,48.77
MOT2_PHASE  (via drill 0.6)
  Top 0.254: U1.PL3 22.22,49.15 22.22,44.45 22.61,44.07 35.05,44.07 37.59,46.61 v37.59,48.77 | MOT2_HB1.20 37.31,56.04 v37.59,55.75
  Bottom 0.254: v37.59,48.77 v37.59,55.75
MOT2_PWM  (via drill 0.6)
  Top 0.254: v38.86,48.77 38.86,44.83 37.59,43.56 31.37,43.56 24,36.2 22.61,36.2 22.1,35.69 22.1,34.04 23.37,32.77 U1.PF3 | MOT2_HB1.21 38.28,56.7 v38.86,57.28
  Bottom 0.254: v38.86,48.77 v38.86,57.28
MOT3_1  (via drill 0.6)
  Top 0.508: MOT3_HB1.5 v35.81,96.65 | MOT3_HB1.10 v35.81,99.95
  Top 1.016: U$9.C1 31.24,117.35 27.69,113.79 27.69,110.87 30.61,107.95 36.2,107.95 37.34,106.81 37.34,101.47 v35.81,99.95
  Bottom 0.61: v35.81,96.65 v35.81,99.95
MOT3_2
  Top 1.016: 35.56,98.3 37.47,98.3 38.61,99.44 38.61,107.31 36.7,109.22 33.91,109.22 31.24,111.89 U$9.C2
  pour Top (no thermals): 35.94,97.92 34.04,97.92 34.04,98.68 35.94,98.68
MOT3_NFAULT  (via drill 0.6)
  Top 0.254: v26.67,106.55 23.75,106.55 U1.PH0 | MOT3_HB1.18 28.09,100.6 27.3,99.82 26.45,99.82 R4.1 26.25,99.95 25.27,99.95 25.15,100.08 25.15,103.5 25.65,104.01 v26.67,104.01
  Bottom 0.254: v26.67,104.01 v26.67,106.55
MOT3_NSLEEP  (via drill 0.6)
  Top 0.254: U1.PH1 23.49,108.58 26.16,108.58 27.94,106.81 v27.94,106.55 | MOT3_HB1.17 27.48,101.27 27.05,100.84 25.65,100.84 25.53,100.97 25.53,102.62 25.91,103 27.56,103 27.94,103.38 v27.94,104.01
  Bottom 0.254: v27.94,104.01 v27.94,106.55
MOT3_PHASE  (via drill 0.6)
  Top 0.254: v25.53,110.36 24.26,110.36 U1.PK6 | MOT3_HB1.20 27.53,99.28 26.29,98.04 v25.65,98.04
  Bottom 0.254: v25.65,98.04 25.65,110.24 v25.53,110.36
MOT3_PWM  (via drill 0.6)
  Top 0.254: MOT3_HB1.21 27.63,98.62 26.16,97.16 26.16,96.27 v25.91,96.01
  Bottom 0.254: v25.91,96.01 U1.PK5
MOT4_1  (via drill 0.6)
  Top 0.508: MOT4_HB1.5 44.46,116.97 v44.07,116.59 | MOT4_HB1.10 44.45,113.67 v44.07,114.05
  Top 1.016: U$7.C1 43.18,116.59 v44.07,116.59
  Bottom 0.61: v44.07,116.59 v44.07,114.05
MOT4_2
  Top 1.016: 46.86,115.32 42.93,115.32 U$7.C2
  pour Top (no thermals): 48.13,114.94 46.48,114.94 46.48,115.7 48.13,115.7
  pour Top (no thermals): 48.13,114.94 46.48,114.94 46.48,115.7 48.13,115.7
MOT4_NFAULT  (via drill 0.6)
  Top 0.254: MOT4_HB1.18 56.5,113.01 v56.52,113.03 56.64,112.9 56.64,111.12 55.75,110.24 R12.1
  Bottom 0.254: U1.PP4 66.04,108.71 64.9,109.86 62.99,109.86 60.07,112.78 56.77,112.78 v56.52,113.03
MOT4_NSLEEP  (via drill 0.6)
  Top 0.254: MOT4_HB1.17 54.78,112.35 v55.37,111.76
  Bottom 0.254: v55.37,111.76 59.18,111.76 63.63,107.31 65.02,107.31 65.28,107.06 65.28,104.9 U1.PD5
MOT4_PHASE  (via drill 0.6)
  Top 0.254: MOT4_HB1.20 56.29,114.33 v56.52,114.55
  Bottom 0.254: 63.88,113.92 U1.PA5 63.25,114.55 v56.52,114.55
MOT4_PWM  (via drill 0.6)
  Top 0.254: MOT4_HB1.21 54.92,114.99 56.52,116.59 v56.52,119.76
  Bottom 0.254: U1.PK4 22.35,94.49 22.35,96.65 22.99,97.28 23.88,97.28 24.64,98.04 24.64,114.17 26.67,116.2 40.77,116.2 43.94,119.38 52.83,119.38 54.1,120.65 55.63,120.65 v56.52,119.76
MOT5_1  (via drill 0.6)
  Top 0.508: v68.96,77.22 MOT5_HB1.5 | MOT5_HB1.10 v68.96,80.51 v68.96,80.52
  Top 1.016: v68.96,80.51 69.21,80.51 71.37,82.68 71.37,87.76 69.21,89.92 69.21,109.6 68.2,110.62 68.2,116.71 U$10.C1
  Bottom 0.61: v68.96,77.22 v68.96,80.52
MOT5_2
  Top 0.254: MOT5_HB1.8
  Top 1.016: U$10.C2 71.5,89.92 72.64,88.77 72.64,81.66 69.85,78.87 67.94,78.87
  pour Top (no thermals): 68.2,78.49 66.55,78.49 66.55,79.25 68.2,79.25
MOT5_NFAULT  (via drill 0.6)
  Top 0.254: v58.29,100.46 U1.PK2 | v56.01,88.77 56.01,100.33 v56.13,100.46 | MOT5_HB1.18 60.6,81.17 59.69,80.26 58.21,80.26 R13.1 56.35,80.3 56.01,80.64 v56.01,83.82
  Bottom 0.254: v56.01,83.82 56.01,84.2 56.77,84.96 56.77,85.98 56.01,86.74 v56.01,88.77 | v56.13,100.46 v58.29,100.46
MOT5_NSLEEP  (via drill 0.6)
  Top 0.254: U1.PK3 57.28,101.98 v57.28,88.77 | v57.28,83.82 57.15,83.69 57.15,81.41 57.4,81.15 59.44,81.15 60.12,81.83 MOT5_HB1.17
  Bottom 0.254: v57.28,83.82 v57.28,88.77
MOT5_PHASE  (via drill 0.6)
  Top 0.254: U1.PQ0 65.28,104.9 65.28,102.74 64.9,102.36 62.1,102.36 58.55,98.81 v58.55,88.77 | MOT5_HB1.20 59.79,79.85 v58.55,78.61
  Bottom 0.254: v58.55,78.61 v58.55,88.77
MOT5_PWM  (via drill 0.6)
  Top 0.254: MOT5_HB1.21 60.65,79.19 58.93,77.47 55.75,77.47 55.12,76.83 55.12,71.63 57.91,68.83 57.91,41.91 58.29,41.53 v58.29,40.89 | v53.59,40.26 40.26,40.26 37.34,43.18 31.62,43.18 23.75,35.31 23.62,35.31 U1.PG0
  Bottom 0.254: v53.59,40.26 57.66,40.26 v58.29,40.89
MTR_PWR  (via drill 0.6)
  Top 0.508: 31.24,62.23 30.35,61.34 30.35,59.69 30,59.34 MOT2_HB1.4 | MOT2_HB1.11 29.99,54.72 30.35,54.36 30.35,53.34 30.86,52.83 31.5,52.83 31.75,52.58 31.75,50.89 32.3,50.89 33.27,49.91 40.77,49.91 | MOT3_HB1.4 33.75,95.98 33.53,95.76 33.53,94.61 32.39,93.47 32.39,91.73 | MOT3_HB1.11 33.89,100.6 33.53,100.97 33.53,102.11 31.33,104.31 C42.2 29.88,105.28 25.4,105.28 24.64,104.52 24.64,90.81 27.81,87.63 40.89,87.63 | MOT4_HB1.4 48.29,117.63 48.64,117.98 48.64,119 50.29,120.65 | MOT5_HB1.4 66.39,76.55 66.04,76.2 66.04,75.18 64.73,73.88 64.73,73.41 | 26.42,81.03 27.3,81.92 28.7,81.92 | 26.42,81.03 25.65,80.26 25.65,78.61 25.3,78.26 MOT1_HB1.4 | 50.29,120.65 50.42,120.78 52.96,120.78 53.47,121.28 | C38.2 49.66,110.36 48.64,111.38 48.64,112.65 48.28,113.01 MOT4_HB1.11 45.83,113.01 43.31,110.49 43.31,100.97 43.94,100.33 | 28.7,81.92 31.5,81.92 32.6,83.02 C54.2 41.4,83.19 | 31.24,62.23 33.78,62.23 | 33.78,62.23 36.96,62.23 37.93,63.21 C34.2 40.89,64.26 | v50.04,72.39 46.48,72.39 | 62.36,73.41 57.66,73.41 57.28,73.03 57.28,72.68 C49.2 v56.01,72.39 | 62.36,73.41 64.73,73.41 | v50.04,85.47 46.1,85.47 45.85,85.72 | 46.48,100.97 50.67,100.97 59.18,109.47 59.18,121.28 57.91,122.56 C39.2 55.33,121.28 53.47,121.28 | C43.2 33.53,91.73 32.39,91.73 | 41.02,88.65 28.45,88.65 27.18,89.92 27.18,90.81 C44.2 27.51,91.73 30.61,91.73 | 41.02,68.96 35.81,68.96 35.56,68.71 | R10.2 28.7,83.02 28.7,81.92 | C53.2 26.42,81.24 26.42,81.03 | 32.39,91.73 30.61,91.73 | R8.2 30.52,91.64 30.61,91.73 | R7.2 53.47,121.63 53.47,121.28 | R6.2 33.62,62.4 33.78,62.23 | C33.2 29.21,64.26 31.24,62.23 | R9.2 62.36,72.39 62.36,73.41
  Top 0.508: C48.2 65.75,72.39 64.73,73.41 | C37.2 48.39,122.56 50.29,120.65 | MOT5_HB1.11 67.96,81.17 69.6,82.8 69.6,87.25 68.58,88.27 61.72,88.27 58.93,85.47 | 58.93,85.47 v55.75,85.47 | C47.2 59.4,85 58.93,85.47 | MOT1_HB1.11 23.73,73.64 22.73,72.64 22.73,68.83 25.53,66.04 32.89,66.04 35.56,68.71 | C52.2 35.09,69.18 35.56,68.71
  Top 0.813: C32.2 31.75,50.89
  Bottom 0.508: v56.01,72.39 v50.04,72.39 | v55.75,85.47 v50.04,85.47
  pour Top (no thermals): 47.5,42.04 40.51,42.04 40.51,101.73 47.5,101.73
N$1
  Top 0.61: U$0.2 30.14,37.47 C3.1
N$2  (via drill 0.6)
  Top 0.61: v34.16,8.38 30.99,5.21 v28.45,5.21
  Bottom 0.61: v34.16,8.38 U$2.4 | v28.45,5.21 26.01,5.21 C8.1
N$3  (via drill 0.6)
  Top 0.61: 49.66,44.26 Q1.1 49.91,44.39 v49.91,41.15 | U$0.5 39.5,34.92 40.13,35.56 v40.77,35.56
  Bottom 0.61: v40.77,35.56 48.77,35.56 49.91,36.7 v49.91,41.15
N$4
  Top 0.406: 56.64,128.27 54.1,130.18 arc-90 54.1,131.44 arc-90 56.64,130.81 56.01,131.44 arc-90 57.28,132.08 arc-90 58.55,130.81 57.91,130.18 56.64,128.27
N$5
  Top 0.61: U3.1 66.96,56.41 C14.1
N$6
  Top 0.61: U3.3 65.53,59.69 64.26,58.42 64.26,55.51 C14.2
N$7
  Top 0.61: 31.28,26.8 R1.1 31.24,25.49 | 31.28,26.8 R2.2 | IC1.3 37.34,24.38 37.08,24.64 35.81,24.64 33.66,26.8 31.28,26.8
N$8  (via drill 0.6)
  Top 0.61: U$5.5 47.24,4.95 46.61,5.59 v43.31,5.59 v41.78,5.59
  Bottom 0.61: 41.78,7.65 U$3.1
  Bottom 0.813: v43.31,5.59 v41.78,5.59 40.77,6.6 40.77,6.99 41.15,7.37 U$3.1
N$9
  Top 0.61: U3.4 70.47,60.96 C15.1
N$10
  Top 0.61: U3.5 70.47,62.23 C15.2
N$11  (via drill 0.6)
  Top 0.61: v65.66,11.94 65.02,11.94 v63.37,10.29 63.37,9.14 59.18,4.95 U$6.5
  Bottom 0.61: v65.66,11.94 v65.65,11.93 U$4.1 | v63.37,10.29 63.37,11.68 63.63,11.94
N$12
  Top 0.61: U3.2 69.33,58.42 C16.1
N$13
  Top 0.61: U3.6 70.24,63.5 C19.1
N$14
  Top 0.61: U3.7 66.17,64.77 65.53,65.41 65.53,66.8 67.56,68.83 72.26,68.83 73.41,67.69 73.41,53.59 RS232_IO.3
N$15
  Top 0.61: U3.8 66.96,66.83 68.07,67.94 71.88,67.94 72.52,67.31 72.52,55.24 70.87,53.59 70.87,51.82 RS232_IO.2
N$17
  Top 0.254: 33.27,65.15 24.38,65.15 23.62,64.39 23.62,60.33 23.95,60 MOT2_HB1.3
  Top 0.406: C34.1 35.35,65.15 33.27,65.15 32.8,65.15 R6.1
N$18
  Top 0.406: MOT2_HB1.1 29.46,61.85 28.74,62.57 C35.2
N$19
  Top 0.406: MOT2_HB1.2 24.98,60.66 C35.1
N$20
  Top 0.254: MOT4_HB1.3 47.05,118.29 46.36,117.6 43.69,117.6 42.67,118.62 42.67,122.68 43.69,123.7 49.28,123.7 49.87,123.1 50.84,123.1
  Top 0.406: C39.1 53.63,123.83 51.56,123.83 50.84,123.1 R7.1
N$21
  Top 0.406: MOT4_HB1.1 44.94,119.61 C40.2
N$22
  Top 0.406: MOT4_HB1.2 44.75,118.95 C40.1
N$23
  Top 0.254: 31.88,89.53 38.23,89.53 38.86,90.17 38.86,94.61 38.16,95.32 MOT3_HB1.3
  Top 0.406: C44.1 28.92,89.95 29.34,89.53 31.88,89.53 32.22,89.88 R8.1
N$24
  Top 0.406: MOT3_HB1.1 34.42,93.64 35.31,92.75 C45.2
N$25
  Top 0.406: C45.1 37,94.66 MOT3_HB1.2
N$26
  Top 0.254: MOT5_HB1.3 72.57,75.89 72.9,75.56 72.9,72.52 71.5,71.12 64.13,71.12 63.63,71.63 63.63,72.17 R9.1
  Top 0.406: R9.1 62.57,71.12 59.82,71.12 59.18,71.75 59.18,72.3 C49.1
N$27
  Top 0.406: MOT5_HB1.1 69.07,74.57 69.98,73.66 71.29,73.66 C50.2
N$28
  Top 0.406: MOT5_HB1.2 71.42,75.23 C50.1
N$29
  Top 0.254: MOT1_HB1.3 24.06,78.92 23.75,78.61 20.45,78.61 19.43,79.63 19.43,83.19 20.45,84.2 27.69,84.2
  Top 0.406: R10.1 26.84,83.35 27.69,84.2 29.88,84.2 C54.1
N$30
  Top 0.406: MOT1_HB1.1 23.64,81.37 C55.2
N$31
  Top 0.406: MOT1_HB1.2 21.34,79.58 C55.1
RX6_MAX_OUT  (via drill 0.6)
  Top 0.406: v72.9,95.89 74.17,94.61 74.17,73.03 71.5,70.36 62.87,70.36 59.82,67.31 59.82,62.87 60.45,62.23 U3.12
  Bottom 0.406: v72.9,95.89 66.67,95.89 U1.PP0
TX6_MAX_IN  (via drill 0.6)
  Top 0.406: v73.41,98.68 74.8,97.28 74.8,72.77 71.75,69.72 65.41,69.72 63.63,67.94 63.63,64.77 62.36,63.5 U3.11
  Bottom 0.406: v73.41,98.68 66.67,98.68 U1.PP1

### Text on the board
tNames: He's lumpy, but he has a big heart | M3 | M4 | M5 | Power OUTPUT | Enc3 | Enc4 | Enc5 | Enc1 | Enc2 | >To gripper | M1 | M2 | power INPUT
bNames: motor3 | motor4 | motor5 | gnd | lgc | act | MRDT / 16-17 Arm board V1 / Drue Satterfield / Rove so duckling hard you won't even believe it | PM_4 ENC1_READ / PA_6 ENC2_READ / PM_6 ENC3_READ / PM_2 ENC4_READ / PM_0 ENC5_READ / PF_3 mot2_PWM / PK_5 mot3_PWM / PK_4 mot4_PWM / PG_0 mot5_PWM / PG_1 mot1_PWM / PP_0 RX / PP_1 TX / PL_1 mot2_NFAULT / PL_2 mot2_NSLEEP / PL_3 mot2_PHASE / PH_0 mot3_NFAULT / PH_1 mot3_NSLEEP / PK_6 mot3_PHASE / PP_4 mot4_NFAULT / PD_5 mot4_NSLEEP / PA_5 mot4_PHASE / PK_2 mot5_NFAULT / PK_3 mot5_NSLEEP / PQ_0 mot5_PHASE / PM_7 mot1_NFAULT / PA_7 mot1_NSLEEP / PP_5 mot1_PHASE / PE_4 POW ENABLE / PE_5 POW NFAULT / PD_3 CURR SENSE | motor1 | motor2 | Gnd | extra | Gnd | logic | act